# Altium project PCB_AI_GATEWAY.PrjPcb
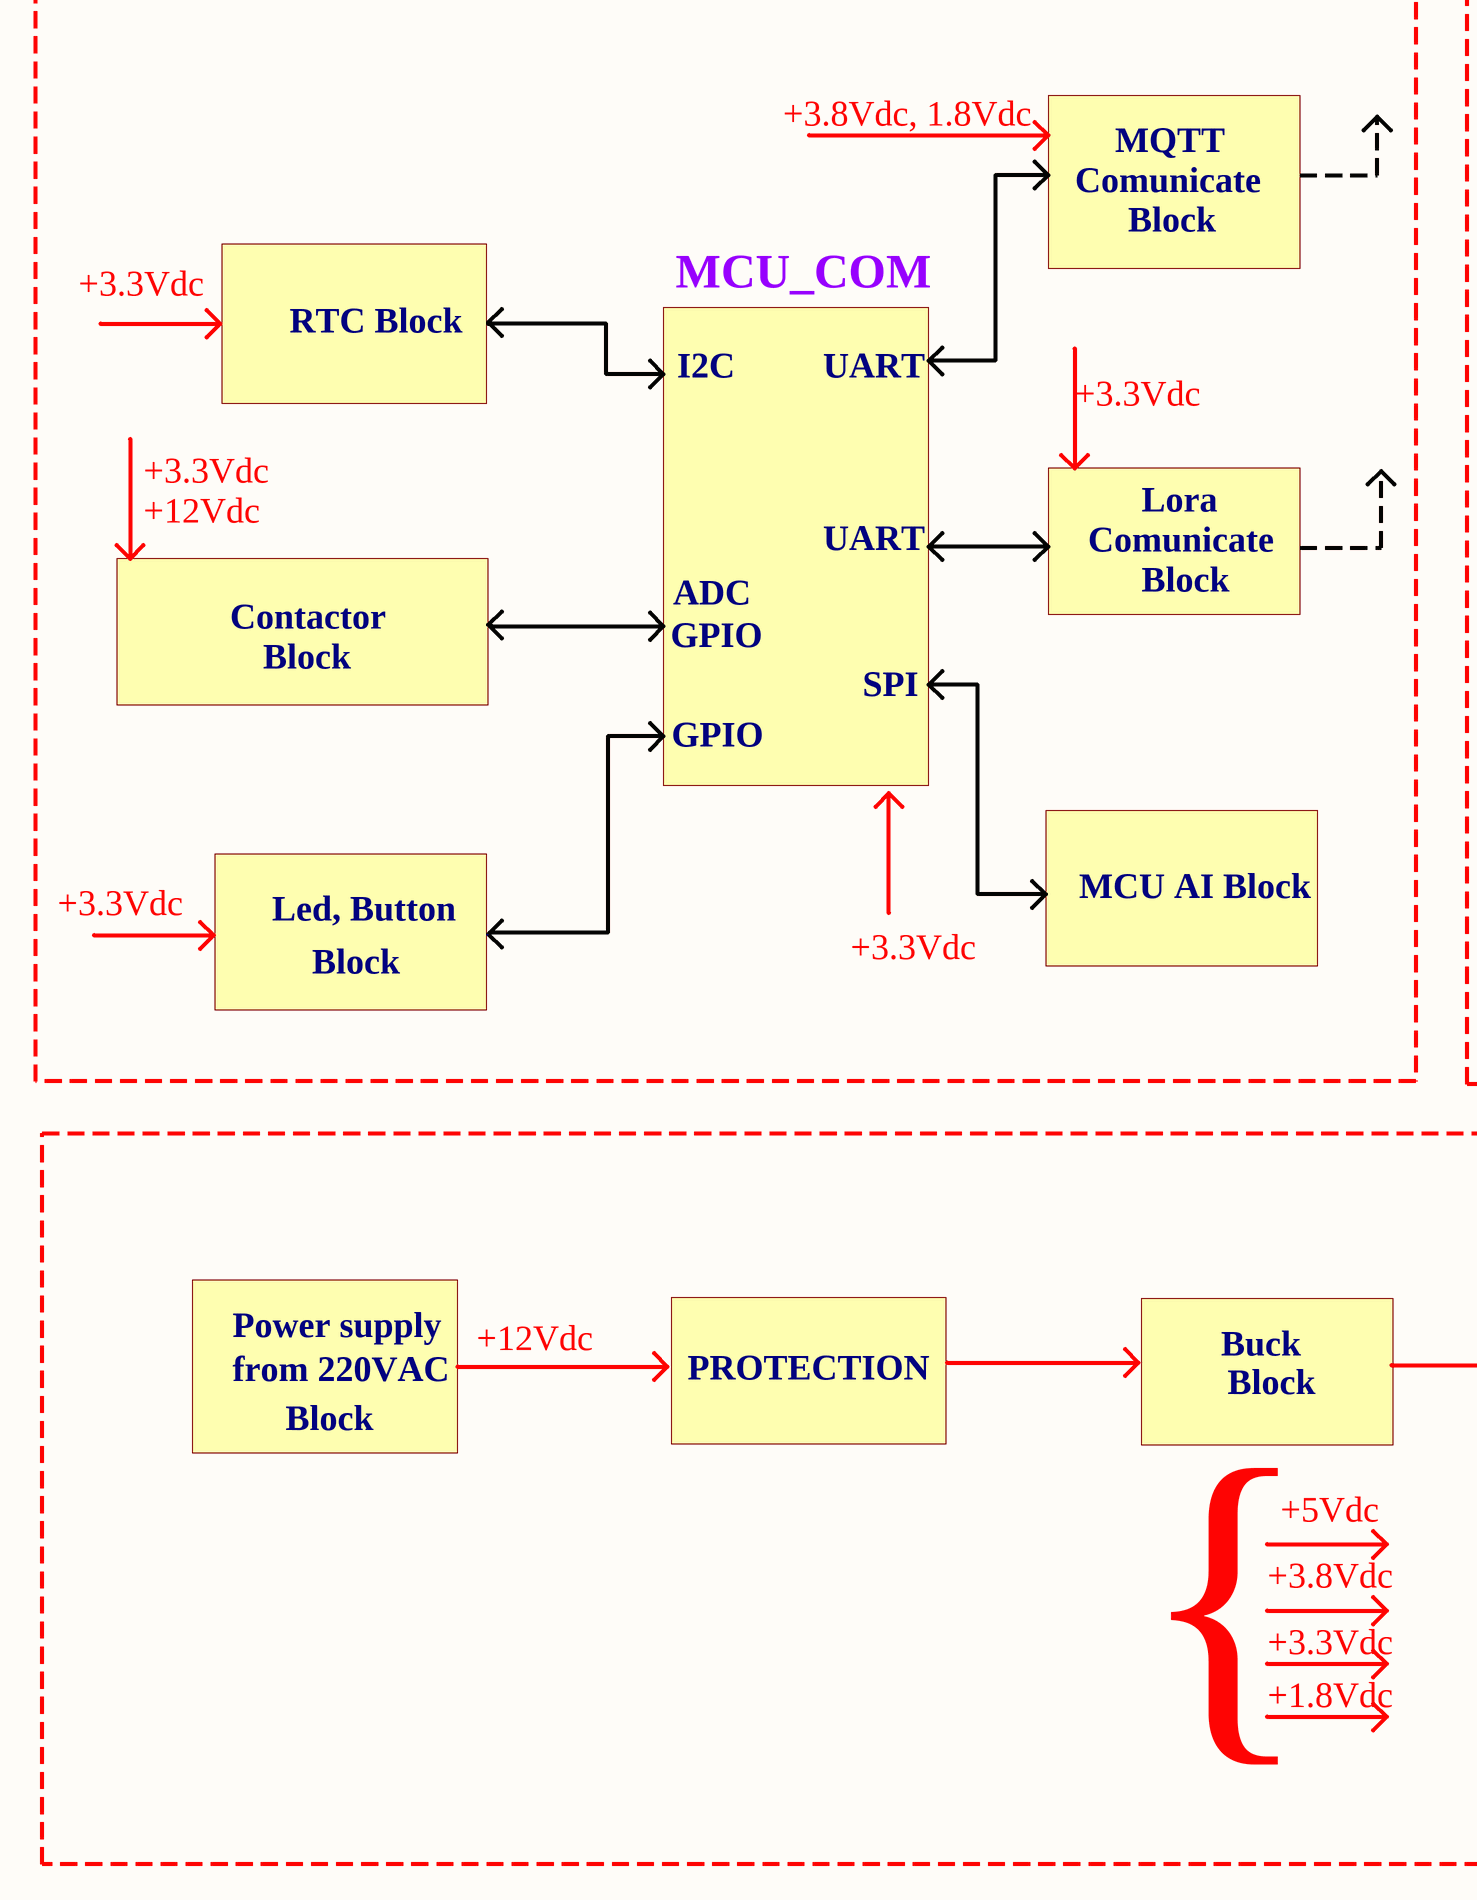
[diagram p0: BLOCK_DIAGRAM.SchDoc, left]
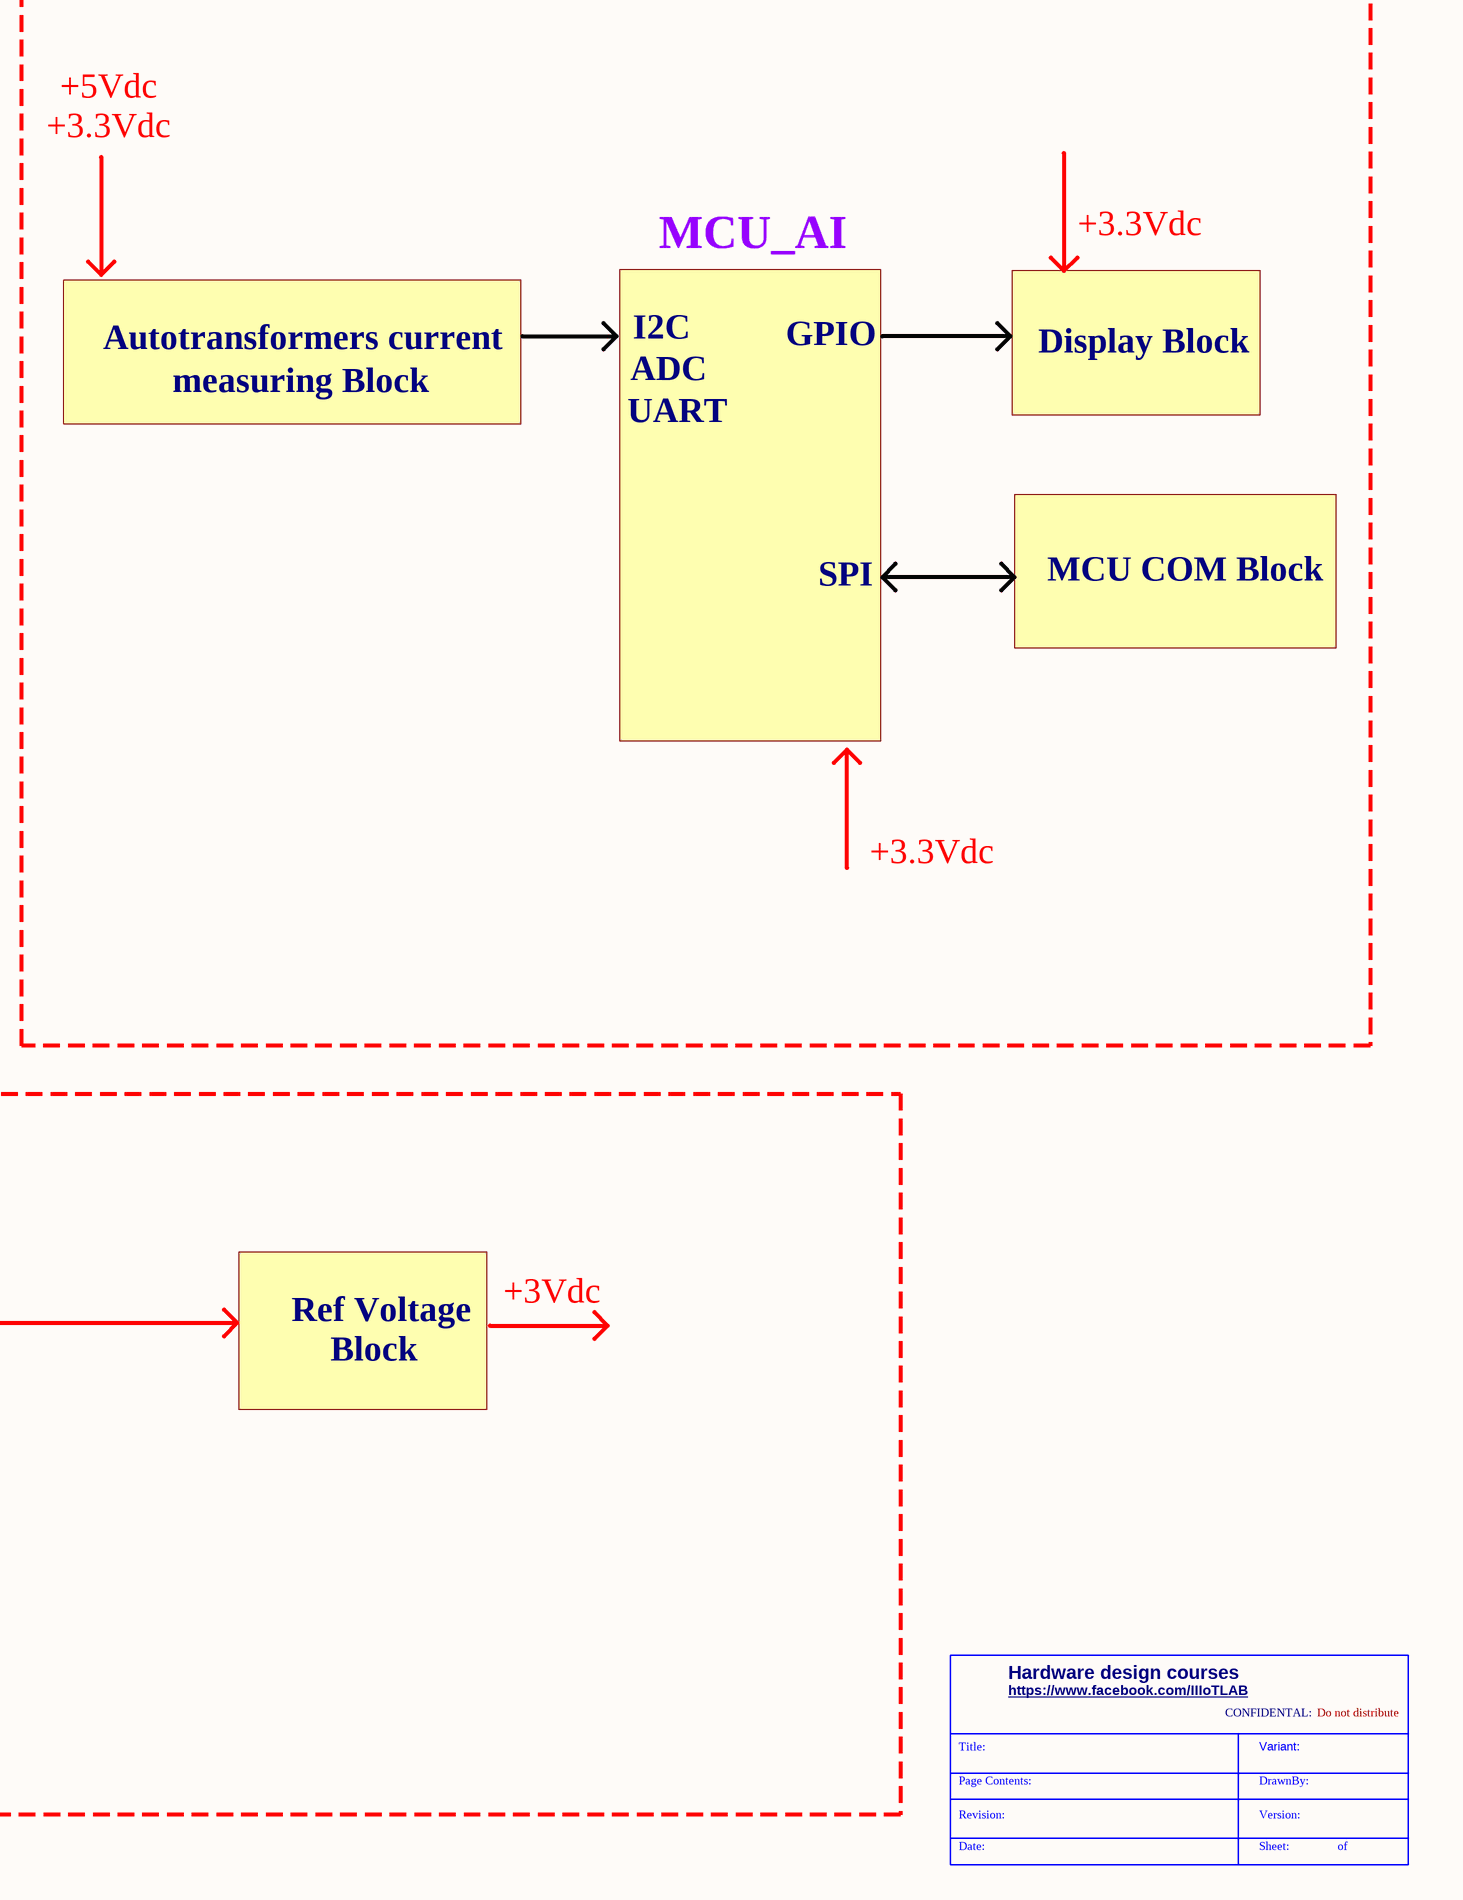
[diagram p1: BLOCK_DIAGRAM.SchDoc, right]
6 sheets, 182 parts. Net scope: global (net labels, ports and power ports of the same name join across sheets).
Board file: PCB1.PcbDoc
Sheets:
  BLOCK_DIAGRAM.SchDoc
  POWER.SchDoc
  MCU.SchDoc
  HW.SchDoc
  COMMUNICATION_INTERFACE.SchDoc
  MEASUREMENT.SchDoc

## Sheet BLOCK_DIAGRAM.SchDoc
size A2; SheetNumber: 1; SheetTotal: 6

### Notes on the sheet
- +3.8Vdc, 1.8Vdc
- MQTT
- +3.3Vdc
- +5Vdc
- Comunicate
- Block
- MCU_COM
- MCU_AI
- RTC Block
- I2C
- UART
- Autotransformers current
- GPIO
- Display Block
- measuring Block
- ADC
- Lora
- +12Vdc
- Contactor
- SPI
- MCU COM Block
- MCU AI Block
- Led, Button
- Power supply
- from 220VAC
- PROTECTION
- Buck
- Ref Voltage
- +3Vdc
- +3.8Vdc
- +1.8Vdc
- Hardware design courses
- https://www.facebook.com/IIIoTLAB
- CONFIDENTAL:
- Do not distribute
- {
- Title:
- Page Contents:
- Variant:
- DrawnBy:
- Revision:
- Date:
- Sheet:
- Version:
- of

## Sheet POWER.SchDoc
size 393 x 304 mm; SheetNumber: 2; SheetTotal: 6
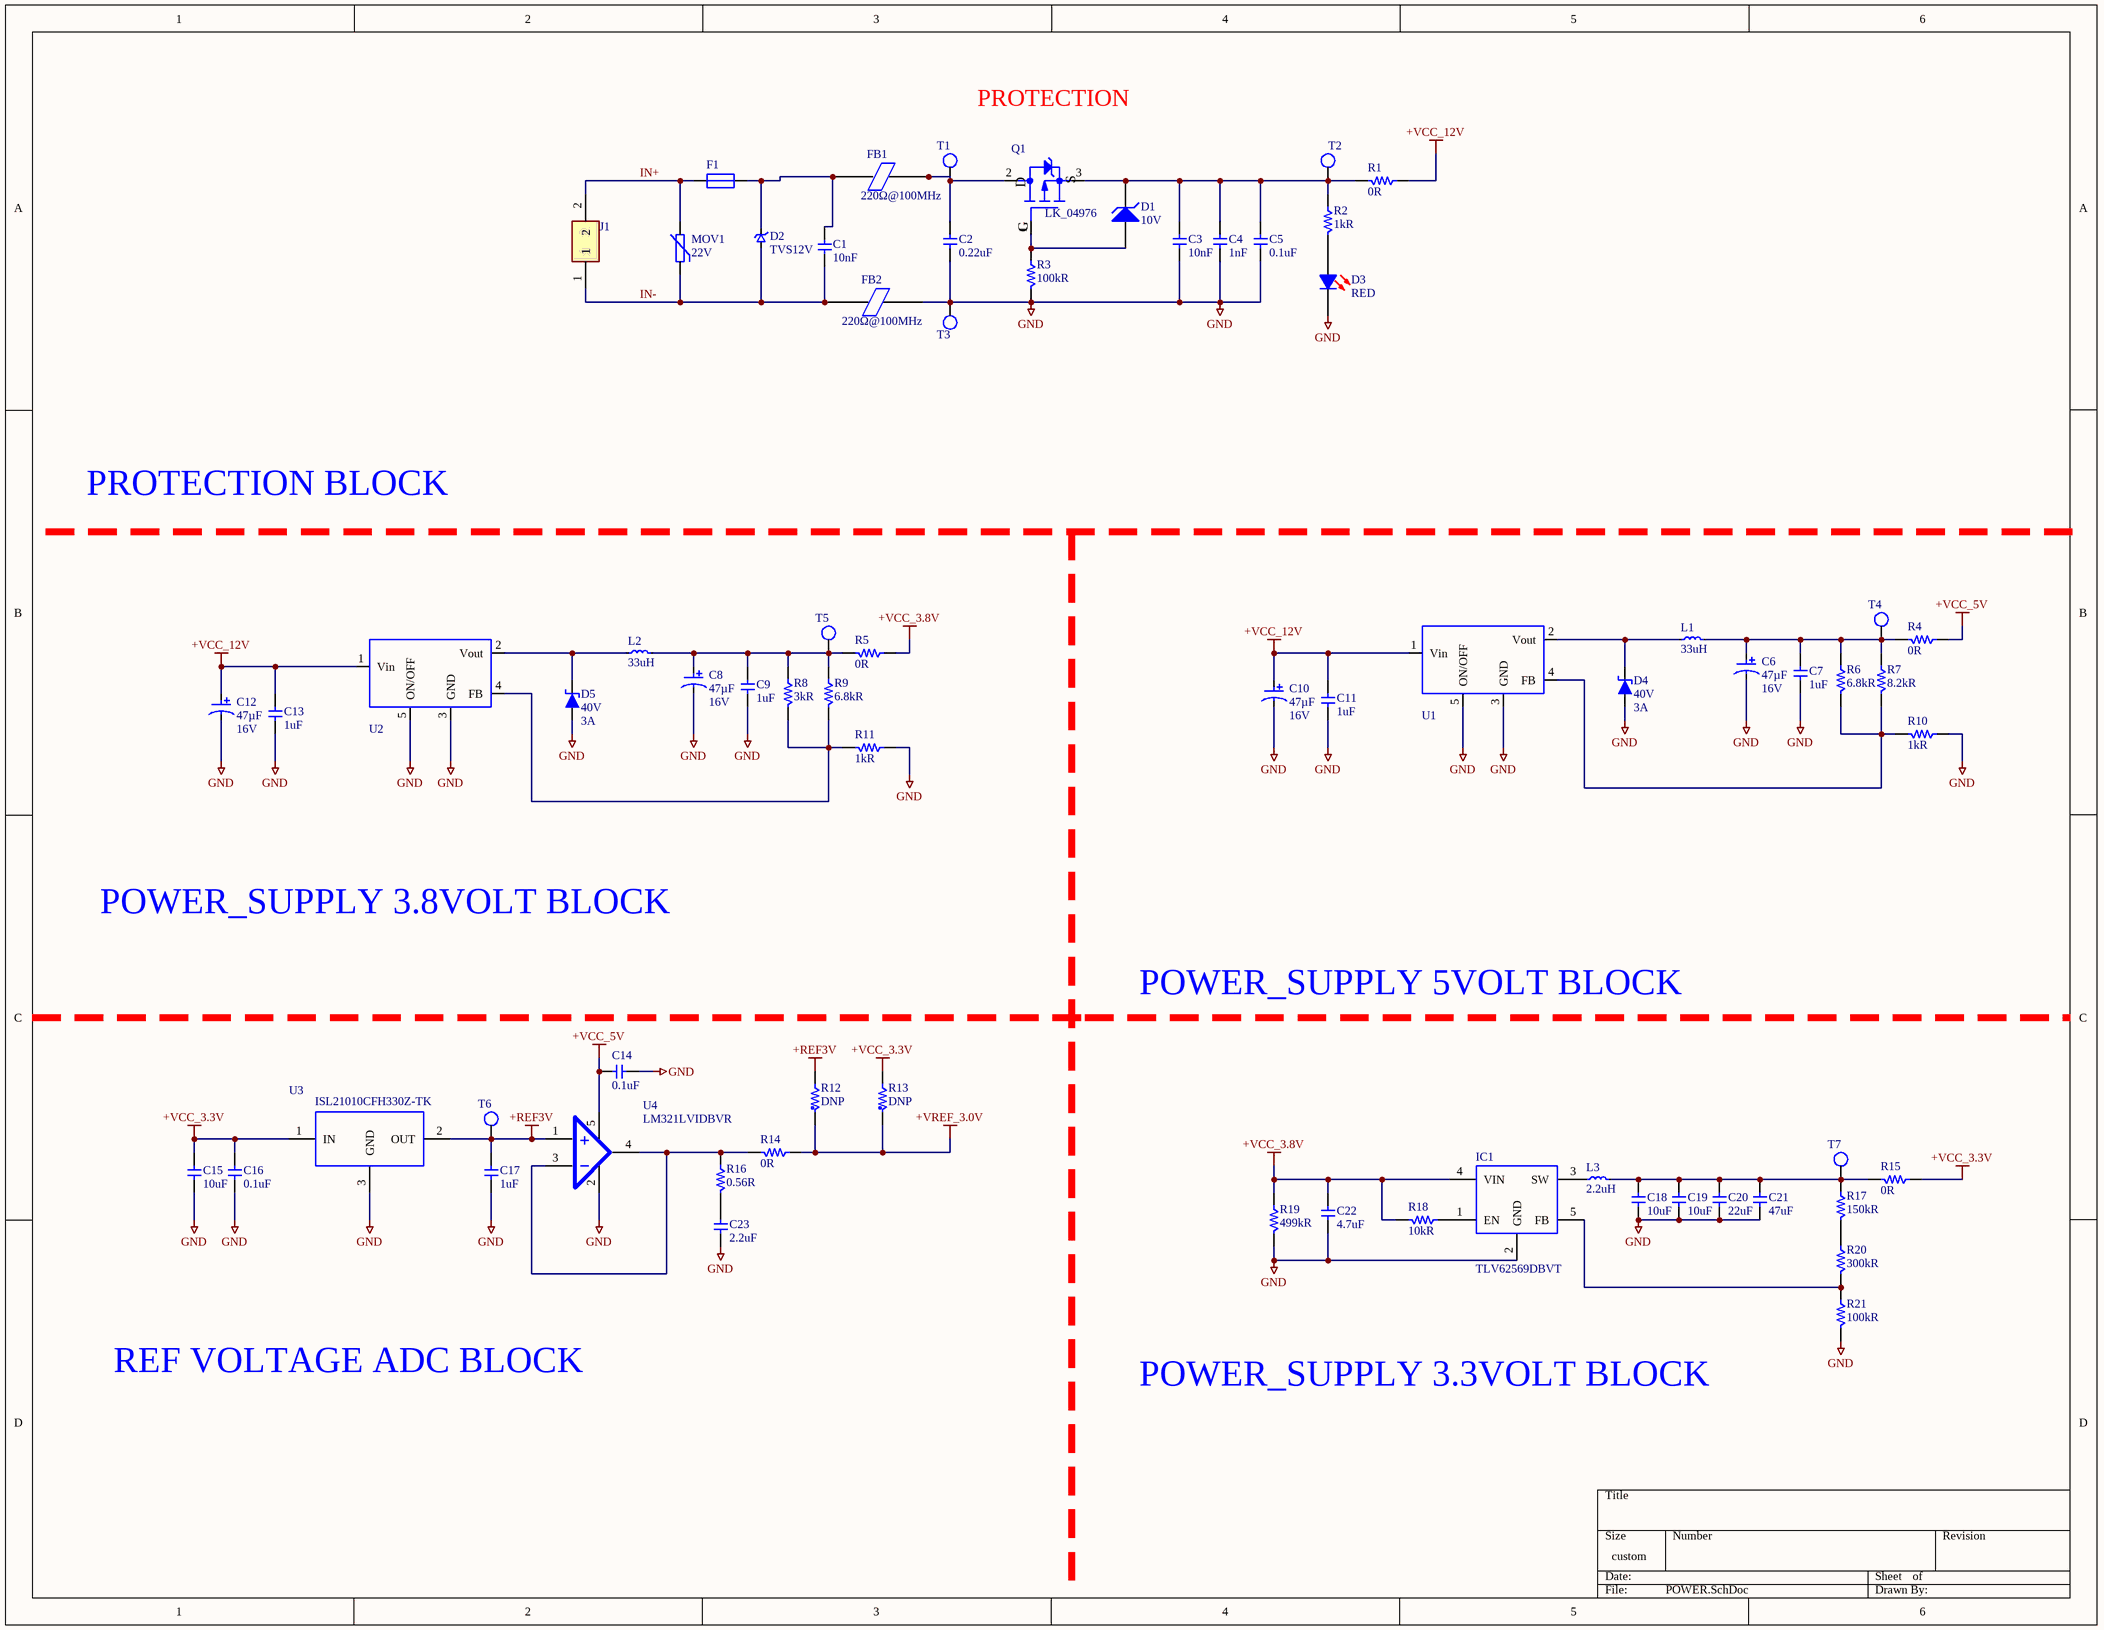
[diagram p2: POWER.SchDoc]

### Parts
C1  10nF  [CAP 0402 (1005)]
C2  0.22uF  [CAP 0402 (1005)]
C3  10nF  [CAP 0402 (1005)]
C4  1nF  [CAP 0402 (1005)]
C5  0.1uF  [CAP 0402 (1005)]
C6  Capacitance: 47µF  Voltage - Rated: 16V  [CAP TANTA 2312]  (hidden comment: TAJC476M016RNJ)
C7  1uF  [CAP 0402 (1005)]
C8  Capacitance: 47µF  Voltage - Rated: 16V  [CAP TANTA 2312]  (hidden comment: TAJC476M016RNJ)
C9  1uF  [CAP 0402 (1005)]
C10  Capacitance: 47µF  Voltage - Rated: 16V  [CAP TANTA 2312]  (hidden comment: TAJC476M016RNJ)
C11  1uF  [CAP 0402 (1005)]
C12  Capacitance: 47µF  Voltage - Rated: 16V  [CAP TANTA 2312]  (hidden comment: TAJC476M016RNJ)
C13  1uF  [CAP 0402 (1005)]
C14  0.1uF  [CAP 0402 (1005)]
C15  10uF  [CAP 0603 (1608)]
C16  0.1uF  [CAP 0402 (1005)]
C17  1uF  [CAP 0402 (1005)]
C18  10uF  [CAP 0603 (1608)]
C19  10uF  [CAP 0603 (1608)]
C20  22uF  [CAP 0805 (2012)]
C21  47uF  [CAP 1206 (3216)]
C22  4.7uF  [CAP 0402 (1005)]
C23  2.2uF  [CAP 0402 (1005)]
D1  10V  [SOT-323]
D2  TVS12V  [TVS SMAj12A]
D3  RED  [LED 0402 RED]
D4  Voltage - DC Reverse (Vr) (Max): 40V  Current - Average Rectified (Io): 3A  [DO-214AC]  (hidden comment: SS34)
D5  Voltage - DC Reverse (Vr) (Max): 40V  Current - Average Rectified (Io): 3A  [DO-214AC]  (hidden comment: SS34)
F1  MF-NSML260/12-2  [FUSC3216X100N]  (value not drawn)
FB1  220Ω@100MHz  [FB 0402 (1005)]
FB2  220Ω@100MHz  [FB 0402 (1005)]
IC1  TLV62569DBVT  [TLV62569DBVR]
J1  B2B-XH-2__LF__SN_  [JST_B2B-XH-A(LF)(SN)]  (value not drawn)
L1  33uH  [CDRH127 (12x12x7MM)]
L2  33uH  [CDRH127 (12x12x7MM)]
L3  2.2uH  [IND_4028]
MOV1  22V  [MOV22]
Q1  LK_04976  [TO-252]
R1  0R  [RES 0603 (1608)]
R2  1kR  [RES 0402 (1005)]
R3  100kR  [RES 0402 (1005)]
R4  0R  [RES 0603 (1608)]
R5  0R  [RES 0603 (1608)]
R6  6.8kR  [RES 0402 (1005)]
R7  8.2kR  [RES 0402 (1005)]
R8  3kR  [RES 0402 (1005)]
R9  6.8kR  [RES 0402 (1005)]
R10  1kR  [RES 0402 (1005)]
R11  1kR  [RES 0402 (1005)]
R12  DNP  [RES 0603 (1608)]
R13  DNP  [RES 0603 (1608)]
R14  0R  [RES 0402 (1005)]
R15  0R  [RES 0603 (1608)]
R16  0.56R  [RES 0402 (1005)]
R17  150kR  [RES 0402 (1005)]
R18  10kR  [RES 0402 (1005)]
R19  499kR  [RES 0402 (1005)]
R20  300kR  [RES 0402 (1005)]
R21  100kR  [RES 0402 (1005)]
T1  TEST_POINT  [TEST POINT]  (value not drawn)
T2  TEST_POINT  [TEST POINT]  (value not drawn)
T3  TEST_POINT  [TEST POINT]  (value not drawn)
T4  TEST_POINT  [TEST POINT]  (value not drawn)
T5  TEST_POINT  [TEST POINT]  (value not drawn)
T6  TEST_POINT  [TEST POINT]  (value not drawn)
T7  TEST_POINT  [TEST POINT]  (value not drawn)
U1  LM2596HVS-ADJ  [TO-263-6]  (value not drawn)
U2  LM2596HVS-ADJ  [TO-263-6]  (value not drawn)
U3  ISL21010CFH330Z-TK  [SOT-23-3]
U4  LM321LVIDBVR  [SOT-23-5]

### Nets
+REF3V: C17.1 R12.2 T6.1 U3.2(OUT) U4.1
+VCC_3.3V: C15.1 C16.1 R13.2 R15.2 U3.1(IN)
+VCC_3.8V: C22.1 IC1.4(VIN) R5.2 R18.1 R19.2
+VCC_5V: C14.2 R4.2 U4.5
+VCC_12V: C10.2(+) C11.1 C12.2(+) C13.1 R1.2 U1.1(Vin) U2.1(Vin)
+VREF_3.0V: R12.1 R13.1 R14.2
GND: C2.2 C3.2 C4.2 C5.2 C6.1(-) C7.2 C8.1(-) C9.2 C10.1(-) C11.2 C12.1(-) C13.2 C14.1 C15.2 C16.2 C17.2 C18.2 C19.2 C20.2 C21.2 C22.2 C23.2 D3.2(K) D4.1(A) D5.1(A) FB2.2 IC1.2(GND) R3.1 R10.2 R11.2 R19.1 R21.1 T3.1 U1.3(GND) U1.5(ON/OFF) U2.3(GND) U2.5(ON/OFF) U3.3(GND) U4.2
IN+: F1.2 J1.2 MOV1.1
IN-: C1.2 D2.2 FB2.1 J1.1 MOV1.2
NetC1_1: C1.1 D2.1 F1.1 FB1.1
NetC2_1: C2.1 FB1.2 Q1.2(D) T1.1
NetC3_1: C3.1 C4.1 C5.1 D1.1(K) Q1.3(S) R1.1 R2.2 T2.1
NetC6_2: C6.2(+) C7.1 L1.2 R4.1 R6.2 R7.2 T4.1
NetC8_2: C8.2(+) C9.1 L2.2 R5.1 R8.2 R9.2 T5.1
NetC18_1: C18.1 C19.1 C20.1 C21.1 L3.2 R15.1 R17.2 T7.1
NetC23_1: C23.1 R16.1
NetD1_2: D1.2(A) Q1.1(G) R3.2
NetD3_1: D3.1(A) R2.1
NetD4_2: D4.2(K) L1.1 U1.2(Vout)
NetD5_2: D5.2(K) L2.1 U2.2(Vout)
NetIC1_1: IC1.1(EN) R18.2
NetIC1_3: IC1.3(SW) L3.1
NetIC1_5: IC1.5(FB) R20.1 R21.2
NetR6_1: R6.1 R7.1 R10.1 U1.4(FB)
NetR8_1: R8.1 R9.1 R11.1 U2.4(FB)
NetR14_1: R14.1 R16.2 U4.3 U4.4
NetR17_1: R17.1 R20.2

### Notes on the sheet
- PROTECTION
- PROTECTION BLOCK
- POWER_SUPPLY 3.8VOLT BLOCK
- POWER_SUPPLY 5VOLT BLOCK
- REF VOLTAGE ADC BLOCK
- POWER_SUPPLY 3.3VOLT BLOCK

### Library data of the parts
C1 C3 = CAP0402 10nF 50V: 50V 10nF ±5% 0402 Multilayer Ceramic Capacitors MLCC - SMD/SMT ROHS; Manufacturer: FH (Guangdong Fenghua Advanced Tech); Manufacturer Part Number: 0402B103J500NT; Supplier: LCSC electronics; Unit Price: $0.0018
C2 = CAP0402 0.22uF 35V: 35V 0.22uF X5R ±10% 0402 Multilayer Ceramic Capacitors MLCC - SMD/SMT ROHS; Manufacturer: Murata Electronics; Manufacturer Part Number: GRT155R6YA224KE01D; Supplier: LCSC electronics; Unit Price: US$ 0.0130
C4 = CAP0402 1nF 50V: 50V 1nF ±5% 0402 Multilayer Ceramic Capacitors MLCC - SMD/SMT ROHS; Manufacturer: Murata Electronics; Manufacturer Part Number: GCM1555C1H102JA16J; Supplier: LCSC electronics; Unit Price: $0.0109
C5 C14 C16 = CAP0402 0.1uF 50V: 50V 100nF ±10% 0402 Multilayer Ceramic Capacitors MLCC - SMD/SMT ROHS; Manufacturer: Samwha Capacitor; Manufacturer Part Number: CS1005X7R104K500NR; Supplier: LCSC electronics; Unit Price: $0.0017
C6 C8 C10 C12 = CAP TANTA 47UF 16V 2312 20%: Manufacturer: AVX Corporation; Manufacturer Size Code: C; Type: Molded; ESR (Equivalent Series Resistance): 500 mOhm; Supplier 1: Digi-Key; Supplier Part Number 1: 478-3912-1-ND; Manufacturer Part Number: TAJC476M016RNJ; RoHS: RoHS Compliant; Category: Capacitors; Stock 1: 1330; Pricing 1: 1=0.96, 10=0.728, 25=0.644, 50=0.6048, 100=0.5208, 250=0.4704 (USD); Packaging: Cut Tape (CT); Part Status: Active; Tolerance: ±20%; Operating Temperature: -55°C ~ 125°C; Lifetime @ Temp.: -; Mounting Type: Surface Mount; Package / Case: 2312 (6032 Metric); Size / Dimension: 0.236" L x 0.126" W (6.00mm x 3.20mm); Height - Seated (Max): 0.110" (2.80mm); Lead Spacing: -; Features: General Purpose; Failure Rate: -; ComponentLink1URL: http://datasheets.avx.com/TAJ.pdf; ComponentLink1Description: http://datasheets.avx.com/TAJ.pdf
C7 C9 C11 C13 C17 = CAP0402 1uF 25V: 25V 1uF ±10% 0402 Multilayer Ceramic Capacitors MLCC - SMD/SMT ROHS; Manufacturer: FH (Guangdong Fenghua Advanced Tech); Manufacturer Part Number: 0402X105K250NT; Supplier: LCSC electronics; Unit Price: US$ 0.0044
C15 C18 C19 = CAP0603 10uF 25V: 25V 10uF X5R ±20% 0603 Multilayer Ceramic Capacitors MLCC - SMD/SMT ROHS; Manufacturer: Chinocera; Manufacturer Part Number: HGC0603R5106M250NTHJ; Supplier: LCSC electronics; Unit Price: $0.0199
C20 = CAP0805 22uF 25V: 25V 22uF X5R ±20% 0805 Multilayer Ceramic Capacitors MLCC - SMD/SMT ROHS; Manufacturer: Murata Electronics; Manufacturer Part Number: GRM21BR61E226ME44L; Supplier: LCSC electronics; Unit Price: $0.0448
C21 = CAP1206 47uF: 47uF ±10% 1206 Multilayer Ceramic Capacitors MLCC - SMD/SMT ROHS; Manufacturer: Murata Electronics; Manufacturer Part Number: GRM31CC80J476KE01L; Supplier: LCSC electronics; Unit Price: $0.1145
C22 = CAP0402 4.7uF 25V: 25V 4.7uF X5R 0402 Multilayer Ceramic Capacitors MLCC - SMD/SMT ROHS; Manufacturer: Murata Electronics; Manufacturer Part Number: GRM155R61E475ME15D; Supplier: LCSC electronics; Unit Price: $0.0433
C23 = CAP0402 2.2uF 35V: 35V 2.2uF X5R ±20% 0402 Multilayer Ceramic Capacitors MLCC - SMD/SMT ROHS; Manufacturer: Murata Electronics; Manufacturer Part Number: GRM155R6YA225ME11D; Supplier: LCSC electronics; Unit Price: $0.0350
D1 = BAT60B: Schottky Diode10V Single 600mV@1A 3A SOD-323 Schottky Barrier Diodes (SBD) ROHS; Manufacturer: High Diode; Manufacturer Part Number: BAT60B; Supplier: LCSC electronics; Unit Price: $0.0317
D2 = TVS DIODE SMAJ12A: TVS DIODE 12VWM 19.9VC DO214AC; Manufacturer: Littelfuse Inc.; Detailed Description: 19.9V Clamp 20.1A Ipp Tvs Diode Surface Mount DO-214AC (SMA); Product status: active; Manufacturer Part Number: SMAJ12A; ComponentLink1Description: Datasheet; ComponentLink1URL: https://www.littelfuse.com/~/media/electronics/datasheets/tvs_diodes/littelfuse_tvs_diode_smaj_datasheet.pdf.pdf; Supplier: https://www.digikey.com/en/products/detail/littelfuse-inc/SMAJ12A/762270; Price: $0.38
D3 = LED RED 0402: Red 0402 Light Emitting Diodes (LED) ROHS; Manufacturer: BrtLed(Bright LED Elec); Manufacturer Part Number: BL-HUB37A-AV-TRB; Supplier: LCSD electronics; Unit Price: $0.0171
D4 D5 = DIO SCHOTTKY 3A 40V: DIO SMD 3A 40V; Manufacturer: Fairchild Semiconductor; Voltage - Forward (Vf) (Max) @ If: 500mV @ 3A; Speed: Fast Recovery =< 500ns, > 200mA (Io); Current - Reverse Leakage @ Vr: 500µA @ 40V; Date: 20160229; Supplier 1: Digi-Key; Manufacturer Part Number: SS34; RoHS: RoHS Compliant; Category: Discrete Semiconductor Products; Stock 1: 36545; Pricing 1: 1=0.54, 10=0.459, 100=0.343, 500=0.26944, 1000=0.20773 (USD); Packaging: Cut Tape (CT); Diode Type: Schottky; Reverse Recovery Time (trr): -; Capacitance @ Vr, F: -; Mounting Type: Surface Mount; Package / Case: DO-214AB, SMC; Supplier Device Package: SMC (DO-214AB); Operating Temperature - Junction: -55°C ~ 150°C; ComponentLink1URL: http://www.fairchildsemi.com/datasheets/SS/SS34.pdf; ComponentLink1Description: http://www.fairchildsemi.com/datasheets/SS/SS34.pdf; Supplier Part Number 1: SS34FSCT-ND
F1 = MF-NSML260_12-2: PTC RESET FUSE 12V 2.6A 1206; Manufacturer: Bourns Inc.; Detailed Description: Polymeric PTC Resettable Fuse 12V 2.6 A Ih Surface Mount 1206 (3216 Metric), Concave; Manufacturer Part Number: MF-NSML260/12-2; Product Status: https://www.digikey.com/en/products/detail/bourns-inc/MF-NSML260-12-2/9859201; Price: $0.94
FB1 FB2 = CMBH1005S221LSP: ±25% 220Ω@100MHz 0402 Ferrite Beads ROHS; Manufacturer: Cybermax; Manufacturer Part Number: CMBH1005S221LSP; Supplier: LCSD electronics; Unit Price: $0.0055
IC1 = TLV62569DBVR: IC REG BUCK ADJ 2A SOT23-5; Manufacturer: Texas Instruments; Detailed Description: Buck Switching Regulator IC Positive Adjustable 0.6V Output 2A SC-74A, SOT-753Buck Switching Regulator IC Positive Adjustable 0.6V Output 2A SC-74A, SOT-753; Product Status: Active; Manufacturer Part Number: TLV62569DBVT; Supplier: https://www.digikey.com/en/products/detail/texas-instruments/TLV62569DBVT/7688204https://www.digikey.com/en/products/detail/texas-instruments/TLV62569DBVT/7688204; ComponentLink1Description: Datasheet; ComponentLink1URL: https://www.ti.com/general/docs/suppproductinfo.tsp?distId=10&gotoUrl=https%3A%2F%2Fwww.ti.com%2Flit%2Fgpn%2Ftlv62569; Price: $1.24
J1 = B2B-XH-2__LF__SN_: Connector; Manufacturer_Name: JST (JAPAN SOLDERLESS TERMINALS); Manufacturer_Part_Number: B2B-XH-2 (LF)(SN); Datasheet Link: http://uk.rs-online.com/web/p/products/1755297; Height: 7mm; Arrow Part Number: B2B-XH-2 (LF)(SN); Arrow Price/Stock: https://www.arrow.com/en/products/b2b-xh-2-lf-sn/jst-manufacturing?region=europe
L1 L2 = IND 33uH 3A 12x12mm: FIXED IND 33UH 3A 59 MOHM SMD; Manufacturer: Sumida; Manufacturer Part Number: CDRH125L125NP-330MC; Supplier 1: Digi-Key; Stock 1: 128; Pricing 1: 1=1.34, 10=1.242, 25=1.1464, 50=0.9556, 100=0.8982, 250=0.8026 (USD); Supplier Part Number 1: 308-CDRH125L125NP-330MCCT-ND
L3 = IND 2.2uH VLS4015CX-2R2M-H: INDUCTORS FOR POWER CIRCUITS, AU; Manufacturer: TDK; Supplier 1: Digi-Key; Manufacturer Part Number: VLS4015CX-2R2M-H; Stock 1: 1572; Pricing 1: 1=0.43, 10=0.384, 25=0.3356, 50=0.2876, 100=0.2637, 250=0.2397, 500=0.2253 (USD); Supplier Part Number 1: 445-VLS4015CX-2R2M-HCT-ND
MOV1 = MOV22: VARISTOR 22V 30A 0603; Manufacturer: Bourns Inc.; Manufacturer Part Number: CG0603MLA-18KE; Detailed Description: 28 V 30 A Varistor 1 Circuit Surface Mount, MLCV 0603 (1608 Metric); Product Status: Active; ComponentLink1Description: Datasheet; ComponentLink1URL: https://www.bourns.com/docs/Product-Datasheets/MLA.pdf; Supplier: https://www.digikey.com/en/products/detail/bourns-inc/CG0603MLA-18KE/2538081; Price: $0.27
Q1 = MOSFET PNP AOD4185 _1: AOD4185 TO252 MOSFET P-1CH 40A 40V; Manufacture: Banlinhkien; Manufacture Part Number: LK_04976
R1 R4 R5 R15 = RES0603 0R: 0Ω 0603 Chip Resistor - Surface Mount ROHS; Manufacturer: KOA Speer Elec; Manufacturer Part Number: RK73Z1JTTD; Supplier: LCSC electronics; Unit Price: $0.0048
R2 R10 R11 = RES0402 1kR 1%: ±5% 1kΩ 0402 Chip Resistor - Surface Mount ROHS; Manufacturer: VO; Manufacturer Part Number: SCR0402J1K; Supplier: LCSC electronics; Unit Price: $0.0004
R3 R21 = RES0402 100k 1%: ±1% 100kΩ 0402 Chip Resistor - Surface Mount ROHS; Manufacturer: VO; Manufacturer Part Number: SCR0402F100K; Supplier: LCSC electronics; Unit Price: $0.0005
R6 R9 = RES0402 6.8k 1%: ±1% 6.8kΩ 0402 Chip Resistor - Surface Mount ROHS; Manufacturer: VO; Manufacturer Part Number: SCR0402F6K8; Supplier: LCSC electronics; Unit Price: $0.0005
R7 = RES0402 5.6k 1%_1: ±1% 5.6kΩ 0402 Chip Resistor - Surface Mount ROHS; Manufacturer: VO; Manufacturer Part Number: SCR0402F5K6; Supplier: LCSC electronics; Unit Price: $0.0005
R8 = RES0402 3kR 1%: ±1% 3kΩ 0402 Chip Resistor - Surface Mount ROHS; Manufacturer: VO; Manufacturer Part Number: SCR0402F3K; Supplier: LCSC electronics; Unit Price: $0.0005
R12 R13 = RES0603 DNP: Res do not populate
R14 = RES0402 0R: 0Ω 0402 Chip Resistor - Surface Mount ROHS; Manufacturer: KOA Speer Elec; Manufacturer Part Number: RK73Z1ETTP; Supplier: LCSC electronics; Unit Price: $0.0072
R16 = RES0402 0.56R 5%: ±5% 560mΩ 0402 Chip Resistor - Surface Mount ROHS; Manufacturer: VO; Manufacturer Part Number: SCR0402JR560; Supplier: LCSC electronics; Unit Price: $0.0027
R17 = RES0402 150kR 1%: ±1% 150kΩ 0402 Chip Resistor - Surface Mount ROHS; Manufacturer: VO; Manufacturer Part Number: SCR0402F150K; Supplier: LCSC electronics; Unit Price: $0.0005
R18 = RES0402 10k 1%: 200mW Thick Film Resistors ±100ppm/℃ ±1% 10kΩ 0402 Chip Resistor - Surface Mount ROHS; Manufacturer: Vishay Intertech; Manufacturer Part Number: RCS040210K0FKED; Supplier: LCSC electronics; Unit Price: $0.0127
R19 = RES0402 499k 1%: ±1% 499kΩ 0402 Chip Resistor - Surface Mount ROHS; Manufacturer: VO; Manufacturer Part Number: SCR0402F499K; Supplier: LCSC electronics; Unit Price: $0.0005
R20 = RES0402 300kR 1%: ±1% 300kΩ 0402 Chip Resistor - Surface Mount ROHS; Manufacturer: VO; Manufacturer Part Number: SCR0402F300K; Supplier: LCSC electronics; Unit Price: $0.0005
U1 U2 = IC LM2596HVS-ADJ: TO-263 DC-DC CONVERTERS ROHS; Manufacturer: TI; Alternative MPN: LK_02154; Manufacturer Part Number: LM2596HVS-ADJ; Supplier 1: CHINA; Supplier Part Number 1: LM2596-ADJ; LINK SALE: http://banlinhkien.vn/goods-2354-lm2596s-adj-buck-adj-3a-to263-5.html
U3 = IC ISL21010CFH330Z-TK: IC VREF SERIES 0.2% SOT23-3; Manufacturer: Intersil; Reference Type: Series, Precision; Voltage - Output: 3V; Temperature Coefficient: 50ppm/°C; Voltage - Input: 3.1 V ~ 5.5 V; Number of Channels: 1; Current - Quiescent: 80µA; Current - Output: 25mA; Supplier 1: Digi-Key; Manufacturer Part Number: ISL21010CFH330Z-TK; Stock 1: 0; Standard Package: 1,000; Category: Integrated Circuits (ICs); Family: PMIC - Voltage Reference; Tolerance: ±0.2%; Operating Temperature: -40°C ~ 125°C; Mounting Type: Surface Mount; Package / Case: TO-236-3, SC-59, SOT-23-3; Supplier Device Package: SOT-23-3; Packaging: Tape & Reel (TR); ComponentLink1URL: http://www.farnell.com/datasheets/1599533.pdf?src-supplier=Element14; ComponentLink1Description: http://www.farnell.com/datasheets/1599533.pdf?src-supplier=Element14; Supplier Part Number 1: ISL21010CFH330Z-TK-ND
U4 = IC OPAM LM321LVIDBVR: IC OPAMP GP 1 CIRCUIT SOT23-5; Manufacturer: Texas Instruments; Alternative MPN: LK_13449; Supplier 1: Digi-Key; Manufacturer Part Number: LM321LVIDBVR; Stock 1: 22892; Pricing 1: 1=0.4, 10=0.304, 25=0.274, 100=0.1894, 250=0.1594, 500=0.1296, 1000=0.0997 (USD); ComponentLink1URL: http://www.ti.com/general/docs/suppproductinfo.tsp?distId=10&amp;gotoUrl=http%3A%2F%2Fwww.ti.com%2Flit%2Fgpn%2Flm321lv&src-supplier=Digi-Key; ComponentLink1Description: http://www.ti.com/general/docs/suppproductinfo.tsp?distId=10&amp;gotoUrl=http%3A%2F%2Fwww.ti.com%2Flit%2Fgpn%2Flm321lv&src-supplier=Digi-Key; Supplier Part Number 1: 296-51261-1-ND

## Sheet MCU.SchDoc
size A4; SheetNumber: 3; SheetTotal: 6
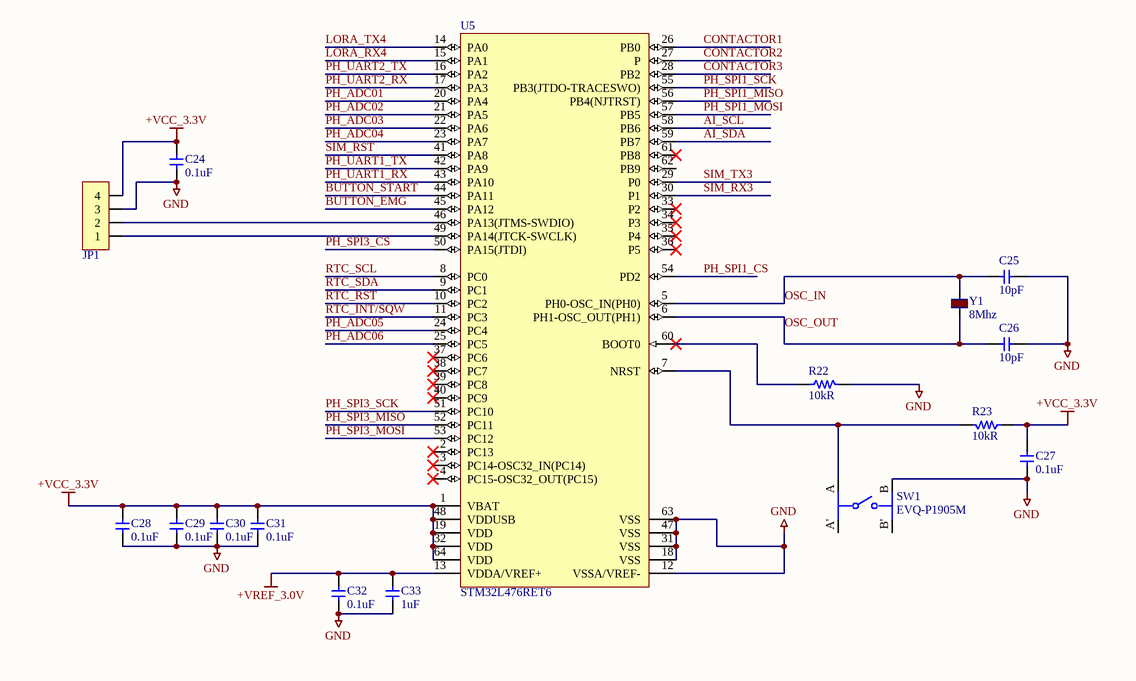
[diagram p3: MCU.SchDoc]

### Parts
C24  0.1uF  [CAP 0402 (1005)]
C25  10pF  [CAP 0402 (1005)]
C26  10pF  [CAP 0402 (1005)]
C27  0.1uF  [CAP 0402 (1005)]
C28  0.1uF  [CAP 0402 (1005)]
C29  0.1uF  [CAP 0402 (1005)]
C30  0.1uF  [CAP 0402 (1005)]
C31  0.1uF  [CAP 0402 (1005)]
C32  0.1uF  [CAP 0402 (1005)]
C33  1uF  [CAP 0402 (1005)]
JP1  JP 1x4 2.54  [JP 1X4 DT]  (value not drawn)
R22  10kR  [RES 0402 (1005)]
R23  10kR  [RES 0402 (1005)]
SW1  EVQ-P1905M  [FP-EVQ-P1905M-MFG]
U5  STM32L476RET6  [STM-LQFP64_L]
Y1  8Mhz  [SMD5032]

### Nets
+VCC_3.3V: C24.1 C27.2 C28.1 C29.1 C30.1 C31.1 JP1.4 R23.2 U5.1(VBAT) U5.19(VDD) U5.32(VDD) U5.48(VDDUSB) U5.64(VDD)
+VREF_3.0V: C32.1 C33.1 U5.13(VDDA/VREF+)
GND: C24.2 C25.1 C26.1 C27.1 C28.2 C29.2 C30.2 C31.2 C32.2 C33.2 JP1.3 R22.1 SW1.B U5.12(VSSA/VREF-) U5.18(VSS) U5.31(VSS) U5.47(VSS) U5.63(VSS)
AI_SCL: U5.58(PB6)
AI_SDA: U5.59(PB7)
BUTTON_EMG: U5.45(PA12)
BUTTON_START: U5.44(PA11)
CONTACTOR1: U5.26(PB0)
CONTACTOR2: U5.27(P)
CONTACTOR3: U5.28(PB2)
LORA_RX4: U5.15(PA1)
LORA_TX4: U5.14(PA0)
OSC_IN: C25.2 U5.5(PH0-OSC_IN(PH0)) Y1.2
OSC_OUT: C26.2 U5.6(PH1-OSC_OUT(PH1)) Y1.1
PH_ADC01: U5.20(PA4)
PH_ADC02: U5.21(PA5)
PH_ADC03: U5.22(PA6)
PH_ADC04: U5.23(PA7)
PH_ADC05: U5.24(PC4)
PH_ADC06: U5.25(PC5)
PH_SPI1_CS: U5.54(PD2)
PH_SPI1_MISO: U5.56(PB4(NJTRST))
PH_SPI1_MOSI: U5.57(PB5)
PH_SPI1_SCK: U5.55(PB3(JTDO-TRACESWO))
PH_SPI3_CS: U5.50(PA15(JTDI))
PH_SPI3_MISO: U5.52(PC11)
PH_SPI3_MOSI: U5.53(PC12)
PH_SPI3_SCK: U5.51(PC10)
PH_UART1_RX: U5.43(PA10)
PH_UART1_TX: U5.42(PA9)
PH_UART2_RX: U5.17(PA3)
PH_UART2_TX: U5.16(PA2)
RTC_INT/SQW: U5.11(PC3)
RTC_RST: U5.10(PC2)
RTC_SCL: U5.8(PC0)
RTC_SDA: U5.9(PC1)
SIM_RST: U5.41(PA8)
SIM_RX3: U5.30(P1)
SIM_TX3: U5.29(P0)
NetJP1_1: JP1.1 U5.49(PA14(JTCK-SWCLK))
NetJP1_2: JP1.2 U5.46(PA13(JTMS-SWDIO))
NetR22_2: R22.2 U5.60(BOOT0)
NetR23_1: R23.1 SW1.A U5.7(NRST)

Not connected (* = marked no-connect by the designer): SW1 A' B'; U5 2(PC13)* 3(PC14-OSC32_IN(PC14))* 4(PC15-OSC32_OUT(PC15))* 33(P2)* 34(P3)* 35(P4)* 36(P5)* 37(PC6)* 38(PC7)* 39(PC8)* 40(PC9)* 61(PB8)* 62(PB9)

### Library data of the parts
C24 C27-C32 = CAP0402 0.1uF 50V: as C5 on sheet POWER; Supplier: LCSC electronics; Unit Price: $0.0017
C25 C26 = CAP0402 10pF 50V: 50V 10pF CH ±2% 0402 Multilayer Ceramic Capacitors MLCC - SMD/SMT ROHS; Manufacturer: Murata Electronics; Manufacturer Part Number: GRM1552C1H100GA01D; Supplier: LCSC electronics; Unit Price: $0.0067
C33 = CAP0402 1uF 25V: as C7 on sheet POWER; Supplier: LCSC electronics; Unit Price: US$ 0.0044
JP1 = JP 1x4 2.54 Duc Thang: Cắm; Ten_Linh_Kien: Jump Đơn Đực 2.54MM 1x40P Thẳng 11MM; Don_Vi: Con; Ma_Hang: MH000903; Ghi_Chu: *; Kieu_Chan: *; Chung_Loai: Cắm
R22 R23 = RES0402 10kR 1%: ±1% 10kΩ 0402 Chip Resistor - Surface Mount ROHS; Manufacturer: VO; Manufacturer Part Number: SCR0402F10K; Supplier: LCSC electronics; Unit Price: $0.0005
SW1 = CMP-05618-000070-1: SWITCH TACTILE SPST-NO 0.05A 12V; Current Rating: 50mA; Operating Force: 1.6N; Illumination Type: Non-Illuminated; Actuator Length: 1.5mm; Actuator Type: Standard; Electrical Life: 100000Cycles; Contact Resistance: 100mR; Actuator Color: Natural; Throw Configuration: SPST; Switch Travel: 1.3mm; Switch Function: Off-Mom; Mount: Surface Mount; Lead Free: Lead Free; Orientation: Straight; REACH SVHC: No SVHC; Max Voltage Rating (DC): 12V; Packaging: Tape and Reel; Mechanical Life: 100000Cycles; Voltage Rating (DC): 12V; Package Quantity: 2000; Series: EVQP1; Case/Package: SMD/SMT; Max Operating Temperature: 85°C; Size: 6.1mm; Contact Plating: Gold; Termination: J-Bend; Min Operating Temperature: -40°C; Radiation Hardening: No; RoHS Compliant: Yes
U5 = CMP-1655-00011-2: Ultra-Low-Power ARM Cortex-M4 32-bit MCU+FPU, 512 KB Flash, 128 KB Internal RAM, 51 I/Os, 64-Pin LQFP, -40 to 85 degC, Tray; Manufacturer: STMicroelectronics; Internal RAM Size (kB): 128; I/Os (High Current): 51; Operating Frequency(F) (Processor speed) (MHz): 80; FLASH Size (Prog) (kB): 512; D/A Converter: 2; Supply Voltage(Vcc) min (V): 1.71; Packing: Tray; DatasheetVersion: Rev. 4; PartNumber: STM32L476RET6; ComponentLink1URL: http://www.st.com/; Package Reference: LQFP64; Package Description: 64-Pin Low-profile Quad Flat Package, Body 10 x 10 mm, Pitch 0.5 mm; Mounting Technology: Surface Mount; ComponentLink1Description: Manufacturer URL; ComponentLink2Description: Datasheet; Core: ARM Cortex-M4; ComponentLink2URL: http://www.st.com/st-web-ui/static/active/en/resource/technical/document/datasheet/DM00108832.pdf
Y1 = CRYSTAL 8MHZ: CRYSTAL 8MHZ SMD5032; Manufacture Part Number: LK_05093; Manufacture: Banlinhkien

## Sheet HW.SchDoc
size A3; SheetNumber: 4; SheetTotal: 6
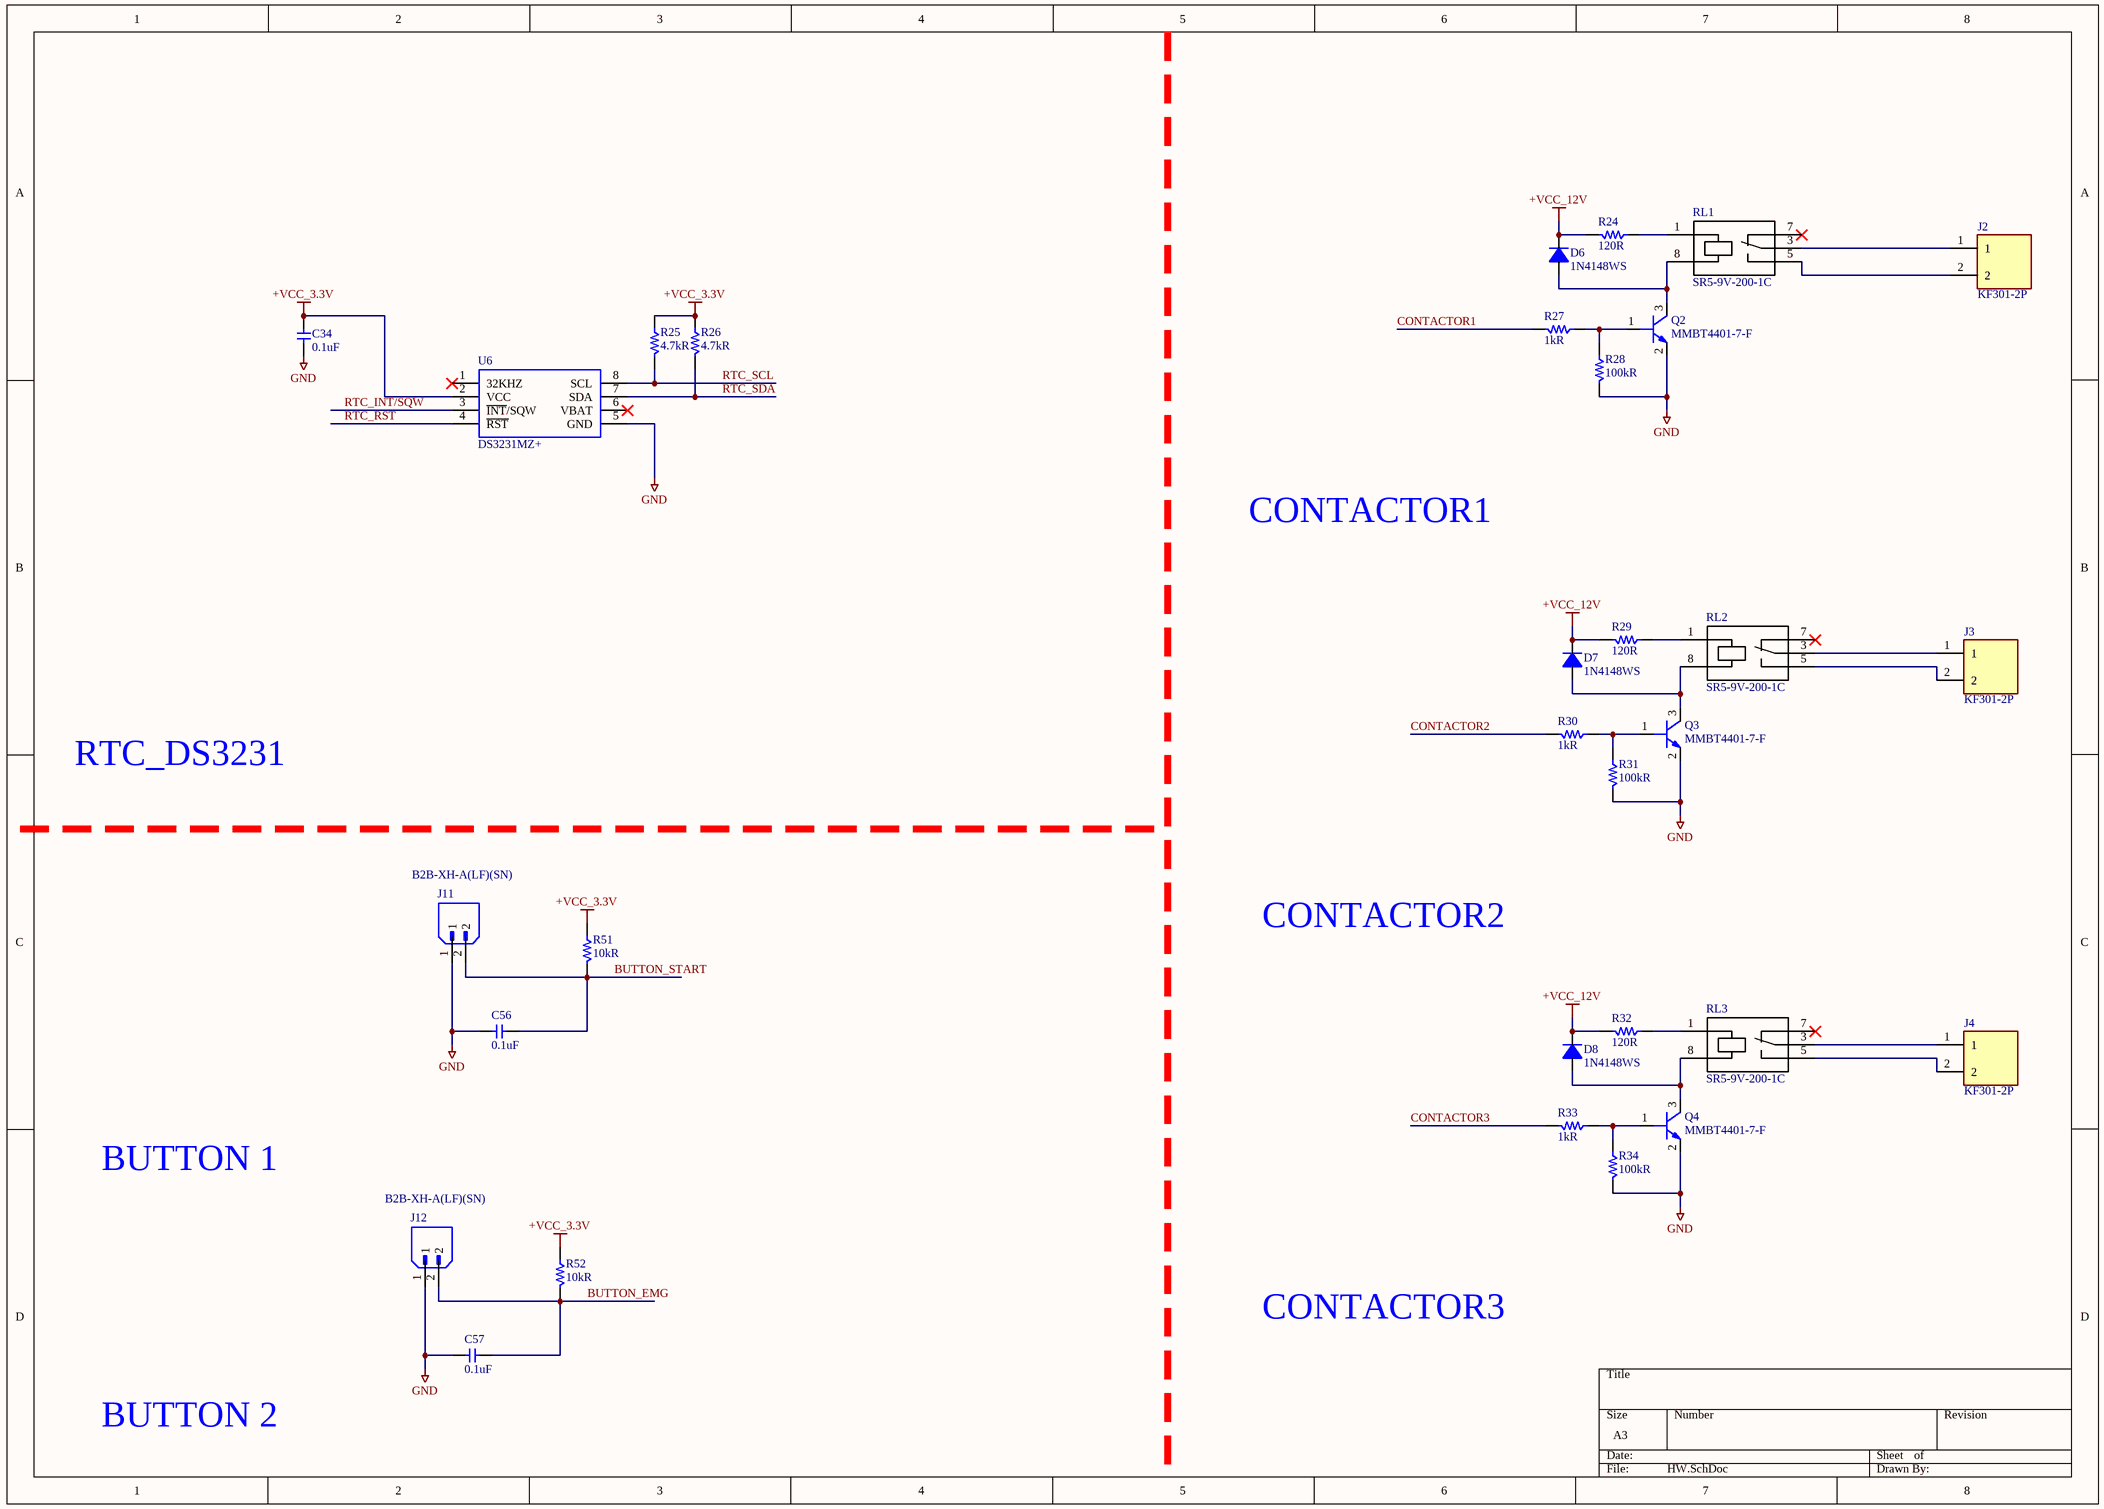
[diagram p4: HW.SchDoc]

### Parts
C34  0.1uF  [CAP 0402 (1005)]
C56  0.1uF  [CAP 0402 (1005)]
C57  0.1uF  [CAP 0402 (1005)]
D6  1N4148WS  [SOD323]
D7  1N4148WS  [SOD323]
D8  1N4148WS  [SOD323]
J2  KF301-2P  [HANDSON_KF301-2P]
J3  KF301-2P  [HANDSON_KF301-2P]
J4  KF301-2P  [HANDSON_KF301-2P]
J11  B2B-XH-A(LF)(SN)  [JST_B2B-XH-A(LF)(SN)]
J12  B2B-XH-A(LF)(SN)  [JST_B2B-XH-A(LF)(SN)]
Q2  MMBT4401-7-F  [SOT-23-3]
Q3  MMBT4401-7-F  [SOT-23-3]
Q4  MMBT4401-7-F  [SOT-23-3]
R24  120R  [RES 0603 (1608)]
R25  4.7kR  [RES 0402 (1005)]
R26  4.7kR  [RES 0402 (1005)]
R27  1kR  [RES 0402 (1005)]
R28  100kR  [RES 0402 (1005)]
R29  120R  [RES 0603 (1608)]
R30  1kR  [RES 0402 (1005)]
R31  100kR  [RES 0402 (1005)]
R32  120R  [RES 0603 (1608)]
R33  1kR  [RES 0402 (1005)]
R34  100kR  [RES 0402 (1005)]
R51  10kR  [RES 0402 (1005)]
R52  10kR  [RES 0402 (1005)]
RL1  SR5-9V-200-1C  [RELAY SR5-9V-200-1C]
RL2  SR5-9V-200-1C  [RELAY SR5-9V-200-1C]
RL3  SR5-9V-200-1C  [RELAY SR5-9V-200-1C]
U6  DS3231MZ+  [SOIC127P600X175-8N]

### Nets
+VCC_3.3V: C34.1 R25.2 R26.2 R51.2 R52.2 U6.2(VCC)
+VCC_12V: D6.1(K) D7.1(K) D8.1(K) R24.1 R29.1 R32.1
GND: C34.2 C56.2 C57.2 J11.1 J12.1 Q2.2(E) Q3.2(E) Q4.2(E) R28.1 R31.1 R34.1 U6.5(GND)
BUTTON_EMG: C57.1 J12.2 R52.1
BUTTON_START: C56.1 J11.2 R51.1
CONTACTOR1: R27.1
CONTACTOR2: R30.1
CONTACTOR3: R33.1
RTC_INT/SQW: U6.3(~{INT}/SQW)
RTC_RST: U6.4(~{RST})
RTC_SCL: R25.1 U6.8(SCL)
RTC_SDA: R26.1 U6.7(SDA)
NetD6_2: D6.2(A) Q2.3(C) RL1.8(C2)
NetD7_2: D7.2(A) Q3.3(C) RL2.8(C2)
NetD8_2: D8.2(A) Q4.3(C) RL3.8(C2)
NetJ2_1: J2.1 RL1.3(C)
NetJ2_2: J2.2 RL1.5(NO)
NetJ3_1: J3.1 RL2.3(C)
NetJ3_2: J3.2 RL2.5(NO)
NetJ4_1: J4.1 RL3.3(C)
NetJ4_2: J4.2 RL3.5(NO)
NetQ2_1: Q2.1(B) R27.2 R28.2
NetQ3_1: Q3.1(B) R30.2 R31.2
NetQ4_1: Q4.1(B) R33.2 R34.2
NetR24_2: R24.2 RL1.1(C1)
NetR29_2: R29.2 RL2.1(C1)
NetR32_2: R32.2 RL3.1(C1)

Not connected (* = marked no-connect by the designer): RL1 7(NC)*; RL2 7(NC)*; RL3 7(NC)*; U6 1(32KHZ)* 6(VBAT)*

### Notes on the sheet
- CONTACTOR1
- RTC_DS3231
- CONTACTOR2
- BUTTON 1
- CONTACTOR3
- BUTTON 2

### Library data of the parts
C34 C56 C57 = CAP0402 0.1uF 50V: as C5 on sheet POWER; Supplier: LCSC electronics; Unit Price: $0.0017
D6-D8 = DIO 1N4148WS: DIODE GEN PURP 75V 150MA SOD323F; Manufacturer: Fairchild/ON Semiconductor; Diode Type: Standard; Voltage - Forward (Vf) (Max) @ If: 1V @ 10mA; Speed: Small Signal =< 200mA (Io), Any Speed; Current - Reverse Leakage @ Vr: 5µA @ 75V; Capacitance @ Vr, F: 4pF @ 0V, 1MHz; Supplier 1: Digi-Key; Manufacturer Part Number: 1N4148WS; RoHS: RoHS Compliant; Category: Discrete Semiconductor Products; Stock 1: 318953; Pricing 1: 1=0.18, 10=0.168, 100=0.0912, 500=0.05614, 1000=0.03827 (USD); Packaging: Cut Tape (CT); Part Status: Active; Current - Average Rectified (Io): 150mA; Mounting Type: Surface Mount; Package / Case: SC-90, SOD-323F; Supplier Device Package: SOD-323F; Operating Temperature - Junction: 150°C (Max); ComponentLink1URL: https://www.fairchildsemi.com/datasheets/1N/1N4148WS.pdf; ComponentLink1Description: https://www.fairchildsemi.com/datasheets/1N/1N4148WS.pdf; Supplier Part Number 1: 1N4148WSFSCT-ND
J2-J4 = KF301-2P: 2 Pin Terminal Block 5mm Pitch; MF: Handson Technology; SnapEDA_Link: https://www.snapeda.com/parts/KF301-2P/Handson+Technology/view-part/?ref=snap; Package: None; Value: *; MP: KF301-2P; Check_prices: https://www.snapeda.com/parts/KF301-2P/Handson+Technology/view-part/?ref=eda
J11 J12 = B2B-XH-A(LF)(SN): Connector Header Through Hole 2 position 0.098 (2.50mm); MF: JST Sales; SnapEDA_Link: https://www.snapeda.com/parts/B2B-XH-A(LF)(SN)/JST/view-part/?ref=snap; Package: None; Value: *; MP: B2B-XH-A(LF)(SN); Check_prices: https://www.snapeda.com/parts/B2B-XH-A(LF)(SN)/JST/view-part/?ref=eda
Q2-Q4 = TRANS MMBT4401-7-F: TRANS NPN 40V 0.6A SMD SOT23-3; Manufacturer: Diodes Incorporated; Vce Saturation (Max) @ Ib, Ic: 750mV @ 50mA, 500mA; DC Current Gain (hFE) (Min) @ Ic, Vce: 100 @ 150mA, 1V; Frequency - Transition: 250MHz; Supplier 1: Digi-Key; Manufacturer Part Number: MMBT4401-7-F; RoHS: RoHS Compliant; Category: Discrete Semiconductor Products; Stock 1: 86548; Pricing 1: 1=0.15, 10=0.134, 100=0.0729, 500=0.04486, 1000=0.03059 (USD); Packaging: Cut Tape (CT); Part Status: Active; Transistor Type: NPN; Current - Collector Cutoff (Max): -; Operating Temperature: -55°C ~ 150°C (TJ); Mounting Type: Surface Mount; Package / Case: TO-236-3, SC-59, SOT-23-3; Supplier Device Package: SOT-23-3; ComponentLink1URL: https://www.diodes.com/assets/Datasheets/ds30039.pdf; ComponentLink1Description: https://www.diodes.com/assets/Datasheets/ds30039.pdf; Supplier Part Number 1: MMBT4401-FDICT-ND
R24 R29 R32 = RES0603 120R 1%: ±1% 120Ω 0603 Chip Resistor - Surface Mount ROHS; Manufacturer: VO; Manufacturer Part Number: SCR0603F120R; Supplier: LCSC electronics; Unit Price: $0.0009
R25 R26 = RES0402 4.7kR 1%: ±1% 4.7kΩ 0402 Chip Resistor - Surface Mount ROHS; Manufacturer: VO; Manufacturer Part Number: SCR0402F4K7; Supplier: LCSC electronics; Unit Price: $0.0005
R27 R30 R33 = RES0402 1kR 1%: as R2 on sheet POWER; Supplier: LCSC electronics; Unit Price: $0.0004
R28 R31 R34 = RES0402 100kR 1%: ±1% 100kΩ 0402 Chip Resistor - Surface Mount ROHS; Manufacturer: VO; Manufacturer Part Number: SCR0402F100K; Supplier: LCSC electronics; Unit Price: $0.0005
R51 R52 = RES0402 10kR 1%: as R22 on sheet MCU; Supplier: LCSC electronics; Unit Price: $0.0005
RL1-RL3 = RELAY 1 FORM C SR5-9V-200-1C: 15.6 X 10.6 X 11.8 MM, 9 V, 1 A,; Manufacturer: CUI Devices; Supplier 1: Digi-Key; Manufacturer Part Number: SR5-9V-200-1C; Stock 1: 985; Pricing 1: 1=1.3, 10=1.218, 25=1.0824, 50=1.0282, 100=0.9742, 250=0.8659, 450=0.8118, 950=0.7577, 9800=0.7198 (USD); Supplier Part Number 1: 2223-SR5-9V-200-1C-ND
U6 = IC DS3231MZ+: I2C SOP-8 Real-time Clocks (RTC) ROHS; Manufacturer: Analog Devices Inc./Maxim Integrated; Manufacturer Part Number: DS3231MZ+TRL; Supplier: LCSD electronics; Unit Price: $1.9887

## Sheet COMMUNICATION_INTERFACE.SchDoc
size A3; SheetNumber: 5; SheetTotal: 6
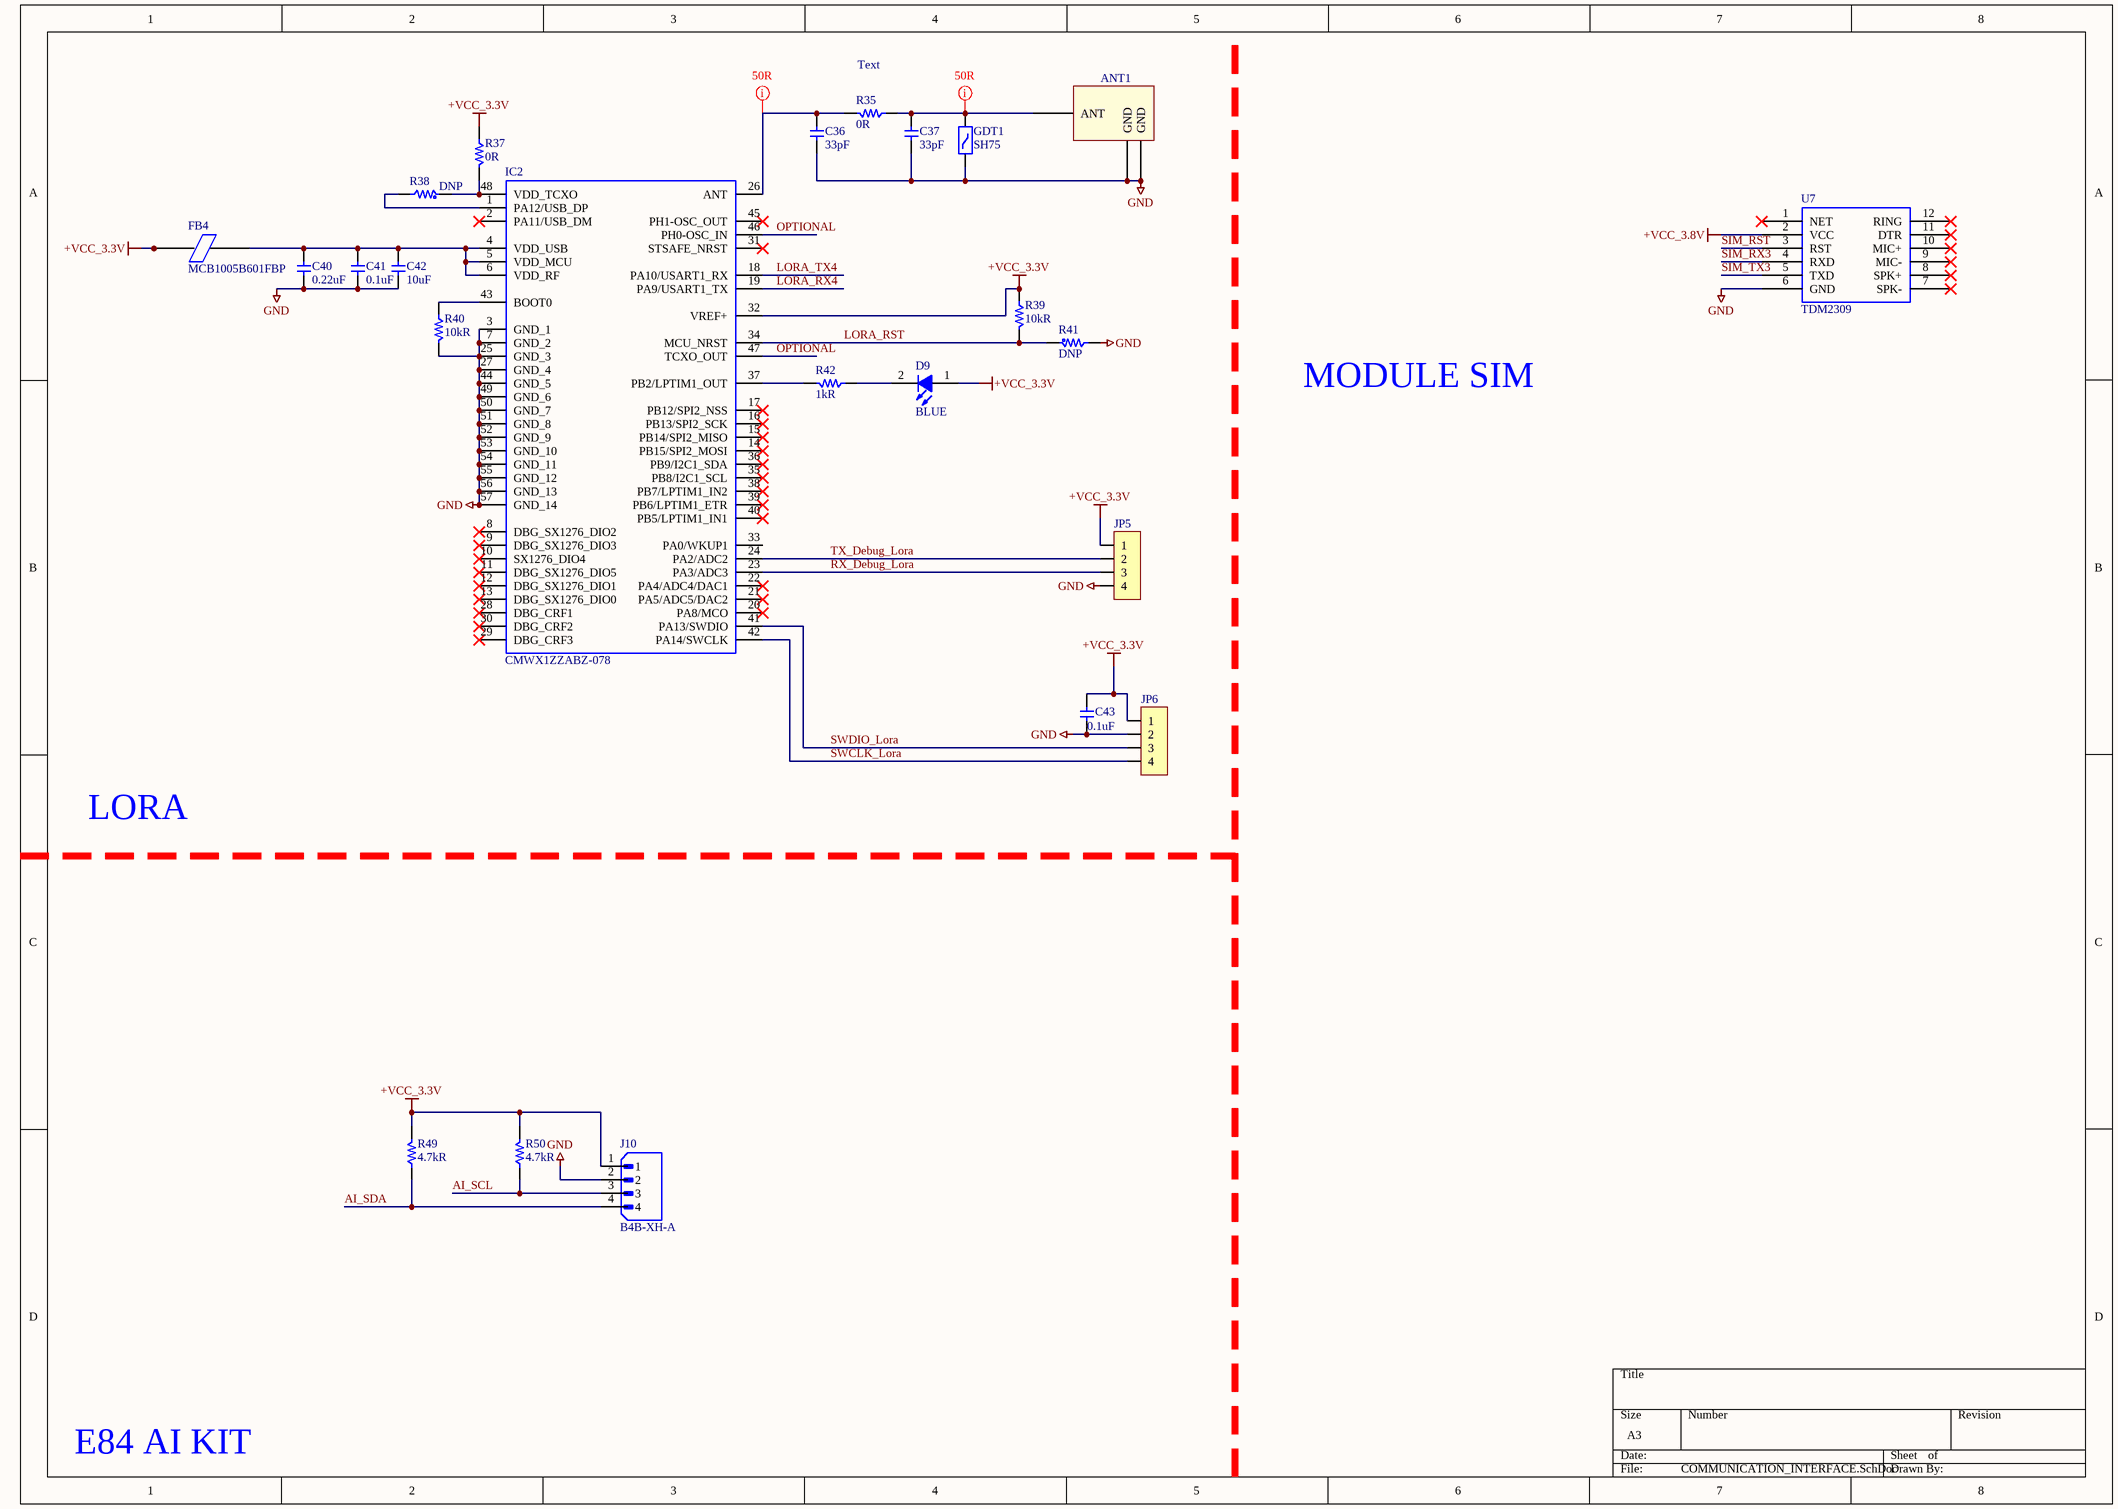
[diagram p5: COMMUNICATION_INTERFACE.SchDoc]

### Parts
ANT1  Anten SMD  [20279-001E-01]  (value not drawn)
C36  33pF  [CAP 0402 (1005)]
C37  33pF  [CAP 0402 (1005)]
C40  0.22uF  [CAP 0402 (1005)]
C41  0.1uF  [CAP 0402 (1005)]
C42  10uF  [CAP 0603 (1608)]
C43  0.1uF  [CAP 0402 (1005)]
D9  BLUE  [LED0402 BLUE]
FB4  MCB1005B601FBP  [FB 0402 (1005)]
GDT1  SH75  [GDT]
IC2  CMWX1ZZABZ-078  [CMWX1ZZABZ-078]
J10  B4B-XH-A  [JST_B4B-XH-A]
JP5  JP 1x4 2.54  [JP 1X4 DT]  (value not drawn)
JP6  JP 1x4 2.54  [JP 1X4 DT]  (value not drawn)
R35  0R  [RES 0603 (1608)]
R37  0R  [RES 0603 (1608)]
R38  DNP  [RES 0603 (1608)]
R39  10kR  [RES 0402 (1005)]
R40  10kR  [RES 0402 (1005)]
R41  DNP  [RES 0402 (1005)]
R42  1kR  [RES 0402 (1005)]
R49  4.7kR  [RES 0402 (1005)]
R50  4.7kR  [RES 0402 (1005)]
U7  TDM2309  [MODULE SIM SIM800L]

### Nets
+VCC_3.3V: C43.1 D9.1(A) FB4.1 IC2.32(VREF+) J10.1 JP5.1 JP6.1 R37.2 R39.2 R49.1 R50.1
+VCC_3.8V: U7.2(VCC)
GND: ANT1.1(GND) ANT1.3(GND) C36.2 C37.2 C40.2 C41.2 C42.2 C43.2 GDT1.1 IC2.3(GND_1) IC2.7(GND_2) IC2.25(GND_3) IC2.27(GND_4) IC2.44(GND_5) IC2.49(GND_6) IC2.50(GND_7) IC2.51(GND_8) IC2.52(GND_9) IC2.53(GND_10) IC2.54(GND_11) IC2.55(GND_12) IC2.56(GND_13) IC2.57(GND_14) J10.2 JP5.4 JP6.2 R40.1 R41.2 U7.6(GND)
AI_SCL: J10.3 R50.2
AI_SDA: J10.4 R49.2
LORA_RST: IC2.34(MCU_NRST) R39.1 R41.1
LORA_RX4: IC2.19(PA9/USART1_TX)
LORA_TX4: IC2.18(PA10/USART1_RX)
OPTIONAL: IC2.46(PH0-OSC_IN) IC2.47(TCXO_OUT)
RX_Debug_Lora: IC2.23(PA3/ADC3) JP5.3
SIM_RST: U7.3(RST)
SIM_RX3: U7.4(RXD)
SIM_TX3: U7.5(TXD)
SWCLK_Lora: IC2.42(PA14/SWCLK) JP6.4
SWDIO_Lora: IC2.41(PA13/SWDIO) JP6.3
TX_Debug_Lora: IC2.24(PA2/ADC2) JP5.2
NetANT1_2: ANT1.2(ANT) C37.1 GDT1.2 R35.2
NetC36_1: C36.1 IC2.26(ANT) R35.1
NetC40_1: C40.1 C41.1 C42.1 FB4.2 IC2.4(VDD_USB) IC2.5(VDD_MCU) IC2.6(VDD_RF)
NetD9_2: D9.2(K) R42.2
NetIC2_1: IC2.1(PA12/USB_DP) R38.2
NetIC2_37: IC2.37(PB2/LPTIM1_OUT) R42.1
NetIC2_43: IC2.43(BOOT0) R40.2
NetIC2_48: IC2.48(VDD_TCXO) R37.1 R38.1

Not connected (* = marked no-connect by the designer): IC2 2(PA11/USB_DM)* 8(DBG_SX1276_DIO2)* 9(DBG_SX1276_DIO3)* 10(SX1276_DIO4)* 11(DBG_SX1276_DIO5)* 12(DBG_SX1276_DIO1)* 13(DBG_SX1276_DIO0)* 14(PB15/SPI2_MOSI)* 15(PB14/SPI2_MISO)* 16(PB13/SPI2_SCK)* 17(PB12/SPI2_NSS)* 20(PA8/MCO)* 21(PA5/ADC5/DAC2)* 22(PA4/ADC4/DAC1)* 28(DBG_CRF1)* 29(DBG_CRF3)* 30(DBG_CRF2)* 31(STSAFE_NRST)* 33(PA0/WKUP1) 35(PB8/I2C1_SCL)* 36(PB9/I2C1_SDA)* 38(PB7/LPTIM1_IN2)* 39(PB6/LPTIM1_ETR)* 40(PB5/LPTIM1_IN1)* 45(PH1-OSC_OUT)*; U7 1(NET)* 7(SPK-)* 8(SPK+)* 9(MIC-)* 10(MIC+)* 11(DTR)* 12(RING)*

### Layout directives
mark named 50R: NetANT1_2, NetC36_1

### Notes on the sheet
- Text
- MODULE SIM
- LORA
- E84 AI KIT

### Library data of the parts
ANT1 = Antenna SMD
C36 C37 = CAP0402 33pF 50V: 50V 33pF NP0 ±5% 0402 Multilayer Ceramic Capacitors MLCC - SMD/SMT ROHS; Manufacturer: YAGEO; Manufacturer Part Number: CC0402JRNPO9BN330; Supplier: LCSC electronics; Unit Price: $0.001
C40 = CAP0402 0.22uF 35V: as C2 on sheet POWER; Supplier: LCSC electronics; Unit Price: US$ 0.0130
C41 C43 = CAP0402 0.1uF 50V: as C5 on sheet POWER; Supplier: LCSC electronics; Unit Price: $0.0017
C42 = CAP0603 10uF 25V: as C15 on sheet POWER; Supplier: LCSC electronics; Unit Price: $0.0199
D9 = LED BLUE 0402: blue 0402 Light Emitting Diodes (LED) ROHS; Manufacturer: BrtLed(Bright LED Elec); Manufacturer Part Number: BL-HB337A-AV-TRB; Supplier: LCSD electronics; Unit Price: $0.0178
FB4 = MCB1005B601FBP: 600mΩ ±25% 600Ω@100MHz 0402 Ferrite Beads ROHS; Manufacturer: INPAQ; Manufacturer Part Number: MCB1005B601FBP; Supplier: LCSD electronics; Unit Price: $0.0023
GDT1 = GDT 75V 5KA 2 POLE SURFACE MOUNT: Gas Discharge Tube 75 V 5000A (5kA) 2 Pole Surface Mount; Manufacturer: Littelfuse; Manufacturer Part Number: SH75; Supplier: Digikey; Unit Price: $1.61
IC2 = CMWX1ZZABZ-078: Integrated Circuit; Manufacturer_Name: Murata Electronics; Datasheet Link: http://www.mouser.com/ds/2/281/Murata_11172016_CMWX1ZZABZ-078-1063304.pdf; Manufacturer_Part_Number: CMWX1ZZABZ-078; Mouser Part Number: 81-CMWX1ZZABZ-078; Mouser Price/Stock: https://www.mouser.co.uk/ProductDetail/Murata-Electronics/CMWX1ZZABZ-078?qs=POvGejmMzm8lN1bzM2%2FdRQ%3D%3D; Arrow Part Number: CMWX1ZZABZ-078; Arrow Price/Stock: https://www.arrow.com/en/products/cmwx1zzabz-078/murata-manufacturing
J10 = B4B-XH-A: Connector Header Through Hole 4 position 0.098 (2.50mm); MF: JST Sales; SnapEDA_Link: https://www.snapeda.com/parts/B4B-XH-A/JST/view-part/?ref=snap; Package: None; Value: *; MP: B4B-XH-A; Check_prices: https://www.snapeda.com/parts/B4B-XH-A/JST/view-part/?ref=eda
JP5 JP6 = JP 1x4 2.54 Duc Thang: as JP1 on sheet MCU; Ghi_Chu: *; Kieu_Chan: *; Chung_Loai: Cắm
R35 R37 = RES0603 0R: as R1 on sheet POWER; Supplier: LCSC electronics; Unit Price: $0.0048
R38 = RES0603 DNP: Res do not populate
R39 R40 = RES0402 10kR 1%: as R22 on sheet MCU; Supplier: LCSC electronics; Unit Price: $0.0005
R41 = RES0402 DNP: Res do not populate
R42 R49 R50 = RES0402 1kR 1%: as R2 on sheet POWER; Supplier: LCSC electronics; Unit Price: $0.0004
U7 = SIM TDM2309: Module 4G SIMCOM A7680C TDM2309; Manufacturer: SIMCOM; Manufacturer Part Number: TDM2309; Supplier: https://linhkienthuduc.com/; Unit Price: 189.000VND

## Sheet MEASUREMENT.SchDoc
size A3; SheetNumber: 6; SheetTotal: 6
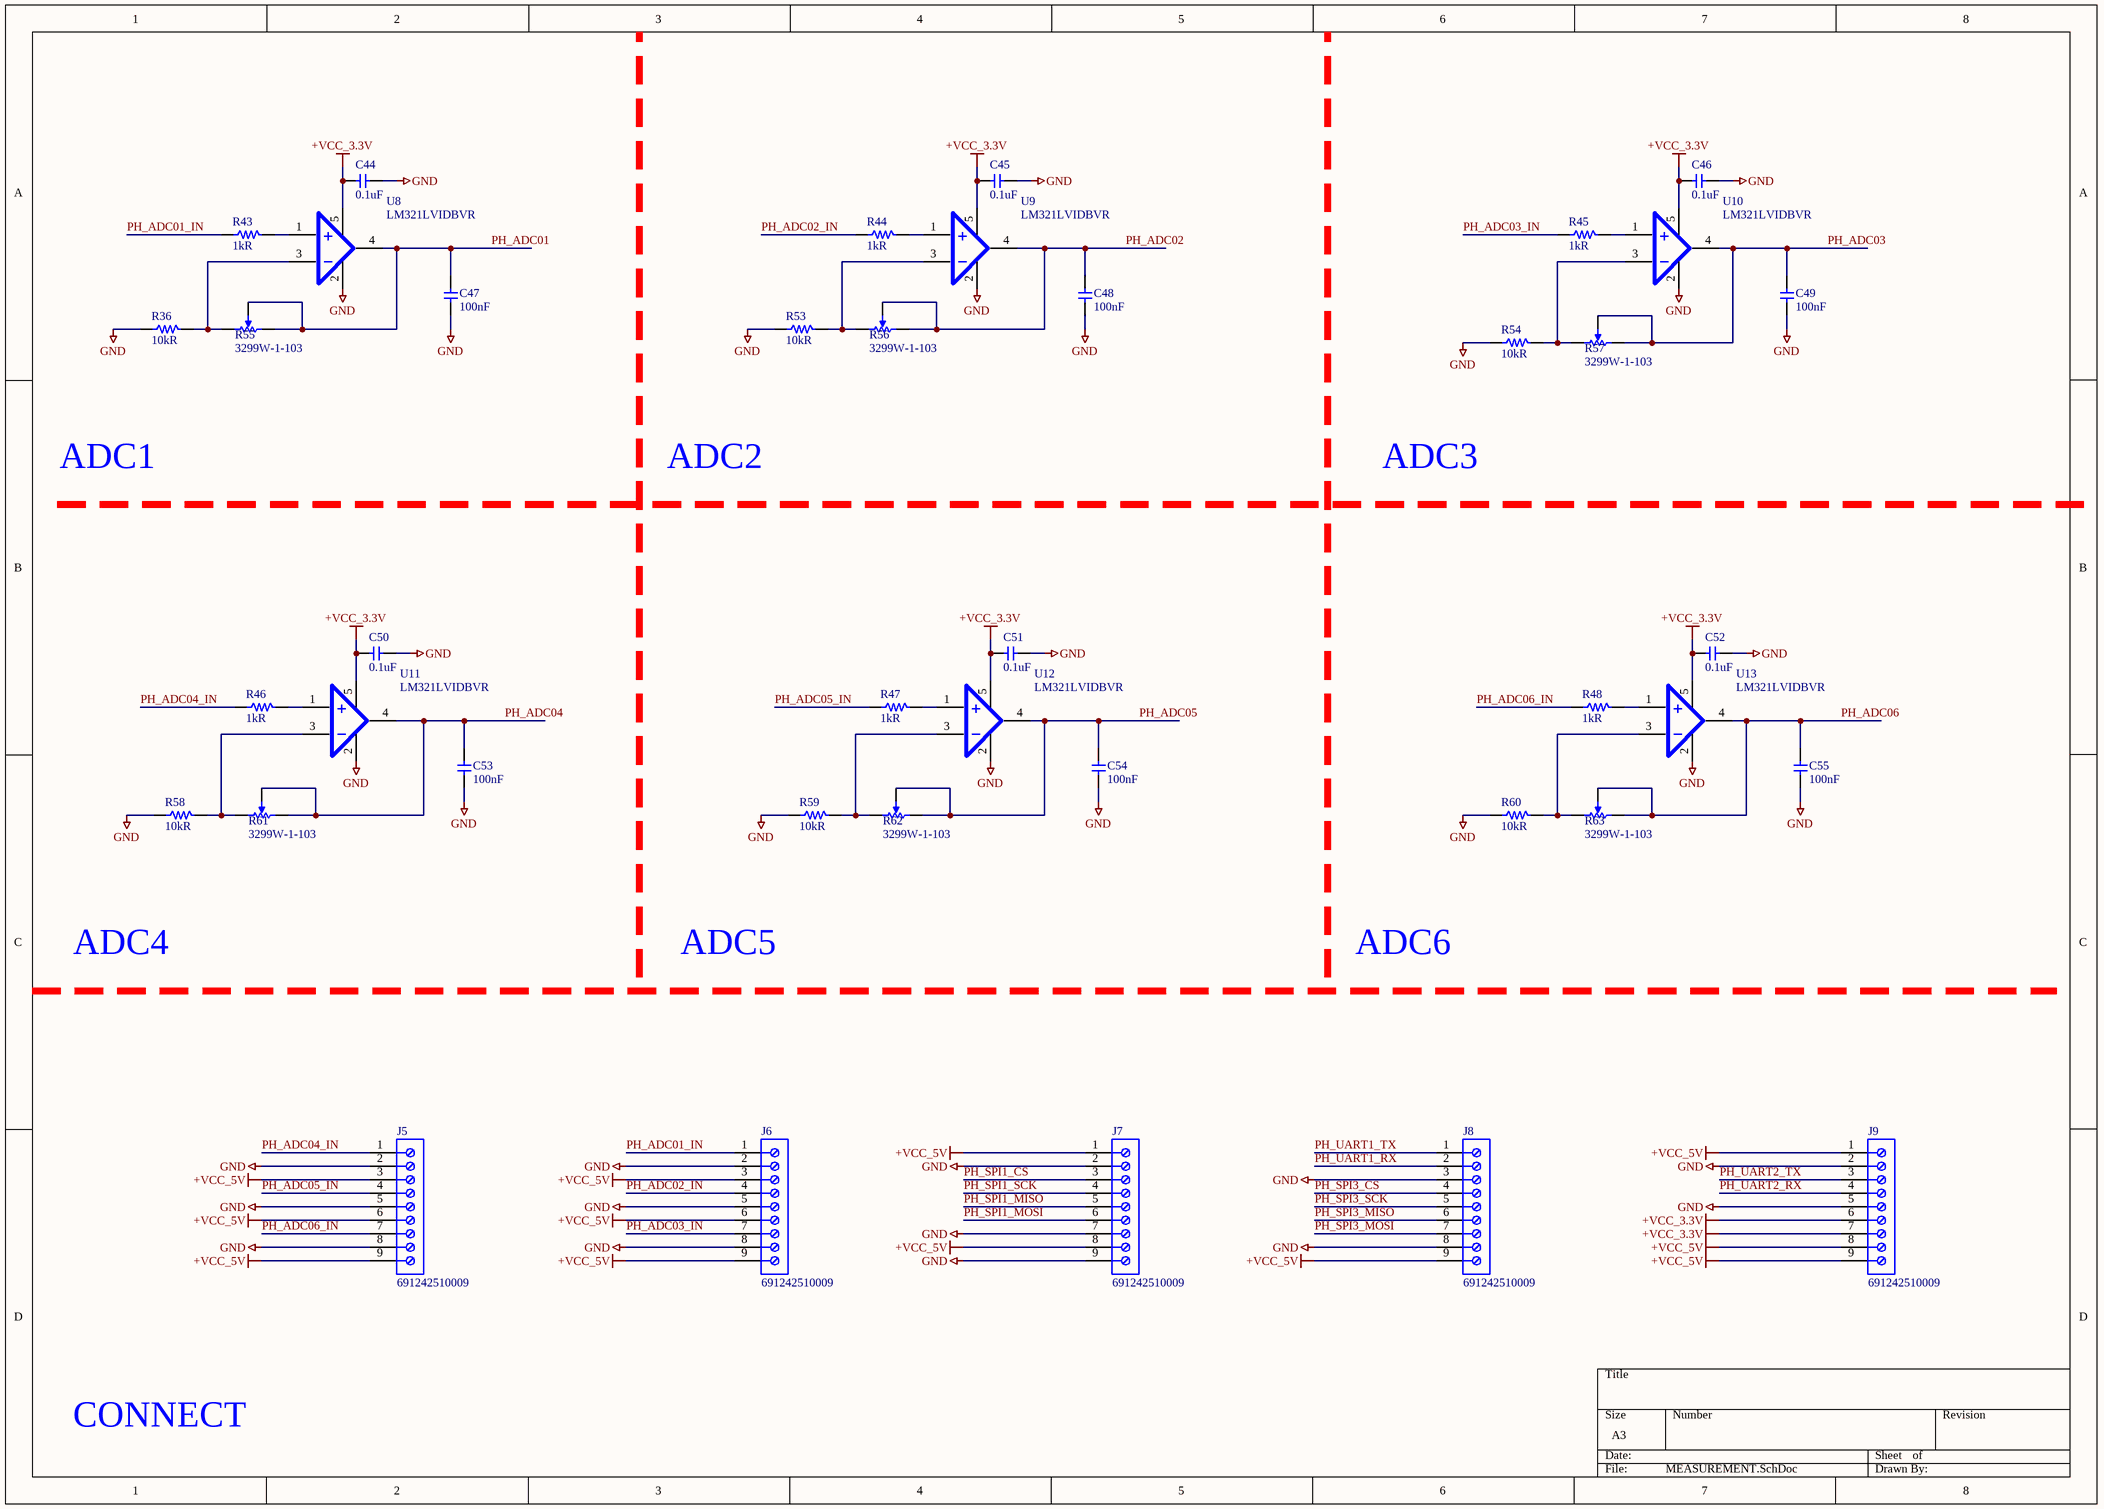
[diagram p6: MEASUREMENT.SchDoc]

### Parts
C44  0.1uF  [CAP 0402 (1005)]
C45  0.1uF  [CAP 0402 (1005)]
C46  0.1uF  [CAP 0402 (1005)]
C47  100nF  [CAP 0402 (1005)]
C48  100nF  [CAP 0402 (1005)]
C49  100nF  [CAP 0402 (1005)]
C50  0.1uF  [CAP 0402 (1005)]
C51  0.1uF  [CAP 0402 (1005)]
C52  0.1uF  [CAP 0402 (1005)]
C53  100nF  [CAP 0402 (1005)]
C54  100nF  [CAP 0402 (1005)]
C55  100nF  [CAP 0402 (1005)]
J5  691242510009  [691242510009]
J6  691242510009  [691242510009]
J7  691242510009  [691242510009]
J8  691242510009  [691242510009]
J9  691242510009  [691242510009]
R36  10kR  [RES 0402 (1005)]
R43  1kR  [RES 0402 (1005)]
R44  1kR  [RES 0402 (1005)]
R45  1kR  [RES 0402 (1005)]
R46  1kR  [RES 0402 (1005)]
R47  1kR  [RES 0402 (1005)]
R48  1kR  [RES 0402 (1005)]
R53  10kR  [RES 0402 (1005)]
R54  10kR  [RES 0402 (1005)]
R55  3299W-1-103  [BOUR-3299W-3_V]
R56  3299W-1-103  [BOUR-3299W-3_V]
R57  3299W-1-103  [BOUR-3299W-3_V]
R58  10kR  [RES 0402 (1005)]
R59  10kR  [RES 0402 (1005)]
R60  10kR  [RES 0402 (1005)]
R61  3299W-1-103  [BOUR-3299W-3_V]
R62  3299W-1-103  [BOUR-3299W-3_V]
R63  3299W-1-103  [BOUR-3299W-3_V]
U8  LM321LVIDBVR  [SOT-23-5]
U9  LM321LVIDBVR  [SOT-23-5]
U10  LM321LVIDBVR  [SOT-23-5]
U11  LM321LVIDBVR  [SOT-23-5]
U12  LM321LVIDBVR  [SOT-23-5]
U13  LM321LVIDBVR  [SOT-23-5]

### Nets
+VCC_3.3V: C44.2 C45.2 C46.2 C50.2 C51.2 C52.2 J9.6 J9.7 U8.5 U9.5 U10.5 U11.5 U12.5 U13.5
+VCC_5V: J5.3 J5.6 J5.9 J6.3 J6.6 J6.9 J7.1 J7.8 J8.9 J9.1 J9.8 J9.9
GND: C44.1 C45.1 C46.1 C47.1 C48.1 C49.1 C50.1 C51.1 C52.1 C53.1 C54.1 C55.1 J5.2 J5.5 J5.8 J6.2 J6.5 J6.8 J7.2 J7.7 J7.9 J8.3 J8.8 J9.2 J9.5 R36.2 R53.2 R54.2 R58.2 R59.2 R60.2 U8.2 U9.2 U10.2 U11.2 U12.2 U13.2
PH_ADC01: C47.2 R55.1 R55.2 U8.4
PH_ADC01_IN: J6.1 R43.2
PH_ADC02: C48.2 R56.1 R56.2 U9.4
PH_ADC02_IN: J6.4 R44.2
PH_ADC03: C49.2 R57.1 R57.2 U10.4
PH_ADC03_IN: J6.7 R45.2
PH_ADC04: C53.2 R61.1 R61.2 U11.4
PH_ADC04_IN: J5.1 R46.2
PH_ADC05: C54.2 R62.1 R62.2 U12.4
PH_ADC05_IN: J5.4 R47.2
PH_ADC06: C55.2 R63.1 R63.2 U13.4
PH_ADC06_IN: J5.7 R48.2
PH_SPI1_CS: J7.3
PH_SPI1_MISO: J7.5
PH_SPI1_MOSI: J7.6
PH_SPI1_SCK: J7.4
PH_SPI3_CS: J8.4
PH_SPI3_MISO: J8.6
PH_SPI3_MOSI: J8.7
PH_SPI3_SCK: J8.5
PH_UART1_RX: J8.2
PH_UART1_TX: J8.1
PH_UART2_RX: J9.4
PH_UART2_TX: J9.3
NetR36_1: R36.1 R55.3 U8.3
NetR43_1: R43.1 U8.1
NetR44_1: R44.1 U9.1
NetR45_1: R45.1 U10.1
NetR46_1: R46.1 U11.1
NetR47_1: R47.1 U12.1
NetR48_1: R48.1 U13.1
NetR53_1: R53.1 R56.3 U9.3
NetR54_1: R54.1 R57.3 U10.3
NetR58_1: R58.1 R61.3 U11.3
NetR59_1: R59.1 R62.3 U12.3
NetR60_1: R60.1 R63.3 U13.3

### Notes on the sheet
- ADC1
- ADC2
- ADC3
- ADC4
- ADC5
- ADC6
- CONNECT

### Library data of the parts
C44-C55 = CAP0402 0.1uF 50V: as C5 on sheet POWER; Supplier: LCSC electronics; Unit Price: $0.0017
J5-J9 = CMP-1502-02641-3: Terminal Block, 5.08MM Pitch, Horizontal, Rising Cage Clamp, 12-30 AWG, 9 Pin
R36 R43-R48 R53 R54 R58-R60 = RES0402 10kR 1%: as R22 on sheet MCU; Supplier: LCSC electronics; Unit Price: $0.0005
R55-R57 R61-R63 = CMP-2000-05584-1: Square Trimpot(R) Trimming Potentiometer, 10 KOhm, +/- 10%, 500 mW, -55 to 125 degC, 3-Pin THD, RoHS, Tube; Element Type: Cermet; Unit Weight: 0.035000oz; Brand: Bourns; Power Rating: 500mW(1/2W); Resistance: 10kOhms; Qualification: Commercial; Adjustment: TopCrossed; Datasheet Version: 04/2014; Product Category: TrimmerResistors-ThroughHole; Mounting Technology: ThroughHole; Manufacturer URL: http://www.bourns.com/; Package Description: 3-Pin Surface Mount Device, Body 9.53 x 6.1 mm, Pitch 2.54 mm; Product: Multiturn; Length: 10.03mm; Termination Style: Pin; Tradename: Trimpot; Type: Trimmers; Manufacturer: Bourns; Width: 9.53mm; Mounting: PanelMount; RoHS: No / RoHSVersionAvailable; Taper: Linear; Datasheet URL: http://www.bourns.com/docs/Product-Datasheets/3299.pdf; Product Type: SquareTrimmingPotentiometer; Package Reference: 3299W; Tolerance: 10%; Series: 3299; Operating Temperature Range: -55Cto+125C; Packaging: Tube
U8-U13 = IC OPAM LM321LVIDBVR: as U4 on sheet POWER; Supplier 1: Digi-Key; Manufacturer Part Number: LM321LVIDBVR; Stock 1: 22892; Pricing 1: 1=0.4, 10=0.304, 25=0.274, 100=0.1894, 250=0.1594, 500=0.1296, 1000=0.0997 (USD); ComponentLink1URL: http://www.ti.com/general/docs/suppproductinfo.tsp?distId=10&amp;gotoUrl=http%3A%2F%2Fwww.ti.com%2Flit%2Fgpn%2Flm321lv&src-supplier=Digi-Key; ComponentLink1Description: http://www.ti.com/general/docs/suppproductinfo.tsp?distId=10&amp;gotoUrl=http%3A%2F%2Fwww.ti.com%2Flit%2Fgpn%2Flm321lv&src-supplier=Digi-Key; Supplier Part Number 1: 296-51261-1-ND

## Nets that join several sheets
+VCC_3.3V: POWER (5 pins), MCU (13 pins), HW (6 pins), COMMUNICATION_INTERFACE (11 pins), MEASUREMENT (14 pins)
+VCC_3.8V: POWER (5 pins), COMMUNICATION_INTERFACE (U7.2)
+VCC_5V: POWER (C14.2 R4.2 U4.5), MEASUREMENT (12 pins)
+VCC_12V: POWER (7 pins), HW (6 pins)
+VREF_3.0V: POWER (R12.1 R13.1 R14.2), MCU (C32.1 C33.1 U5.13)
GND: POWER (39 pins), MCU (18 pins), HW (12 pins), COMMUNICATION_INTERFACE (29 pins), MEASUREMENT (37 pins)
AI_SCL: MCU (U5.58), COMMUNICATION_INTERFACE (J10.3 R50.2)
AI_SDA: MCU (U5.59), COMMUNICATION_INTERFACE (J10.4 R49.2)
BUTTON_EMG: MCU (U5.45), HW (C57.1 J12.2 R52.1)
BUTTON_START: MCU (U5.44), HW (C56.1 J11.2 R51.1)
CONTACTOR1: MCU (U5.26), HW (R27.1)
CONTACTOR2: MCU (U5.27), HW (R30.1)
CONTACTOR3: MCU (U5.28), HW (R33.1)
LORA_RX4: MCU (U5.15), COMMUNICATION_INTERFACE (IC2.19)
LORA_TX4: MCU (U5.14), COMMUNICATION_INTERFACE (IC2.18)
PH_ADC01: MCU (U5.20), MEASUREMENT (C47.2 R55.1 R55.2 U8.4)
PH_ADC02: MCU (U5.21), MEASUREMENT (C48.2 R56.1 R56.2 U9.4)
PH_ADC03: MCU (U5.22), MEASUREMENT (C49.2 R57.1 R57.2 U10.4)
PH_ADC04: MCU (U5.23), MEASUREMENT (C53.2 R61.1 R61.2 U11.4)
PH_ADC05: MCU (U5.24), MEASUREMENT (C54.2 R62.1 R62.2 U12.4)
PH_ADC06: MCU (U5.25), MEASUREMENT (C55.2 R63.1 R63.2 U13.4)
PH_SPI1_CS: MCU (U5.54), MEASUREMENT (J7.3)
PH_SPI1_MISO: MCU (U5.56), MEASUREMENT (J7.5)
PH_SPI1_MOSI: MCU (U5.57), MEASUREMENT (J7.6)
PH_SPI1_SCK: MCU (U5.55), MEASUREMENT (J7.4)
PH_SPI3_CS: MCU (U5.50), MEASUREMENT (J8.4)
PH_SPI3_MISO: MCU (U5.52), MEASUREMENT (J8.6)
PH_SPI3_MOSI: MCU (U5.53), MEASUREMENT (J8.7)
PH_SPI3_SCK: MCU (U5.51), MEASUREMENT (J8.5)
PH_UART1_RX: MCU (U5.43), MEASUREMENT (J8.2)
PH_UART1_TX: MCU (U5.42), MEASUREMENT (J8.1)
PH_UART2_RX: MCU (U5.17), MEASUREMENT (J9.4)
PH_UART2_TX: MCU (U5.16), MEASUREMENT (J9.3)
RTC_INT/SQW: MCU (U5.11), HW (U6.3)
RTC_RST: MCU (U5.10), HW (U6.4)
RTC_SCL: MCU (U5.8), HW (R25.1 U6.8)
RTC_SDA: MCU (U5.9), HW (R26.1 U6.7)
SIM_RST: MCU (U5.41), COMMUNICATION_INTERFACE (U7.3)
SIM_RX3: MCU (U5.30), COMMUNICATION_INTERFACE (U7.4)
SIM_TX3: MCU (U5.29), COMMUNICATION_INTERFACE (U7.5)